# EasyEDA Pro project PCB.epro, board PCB1_1
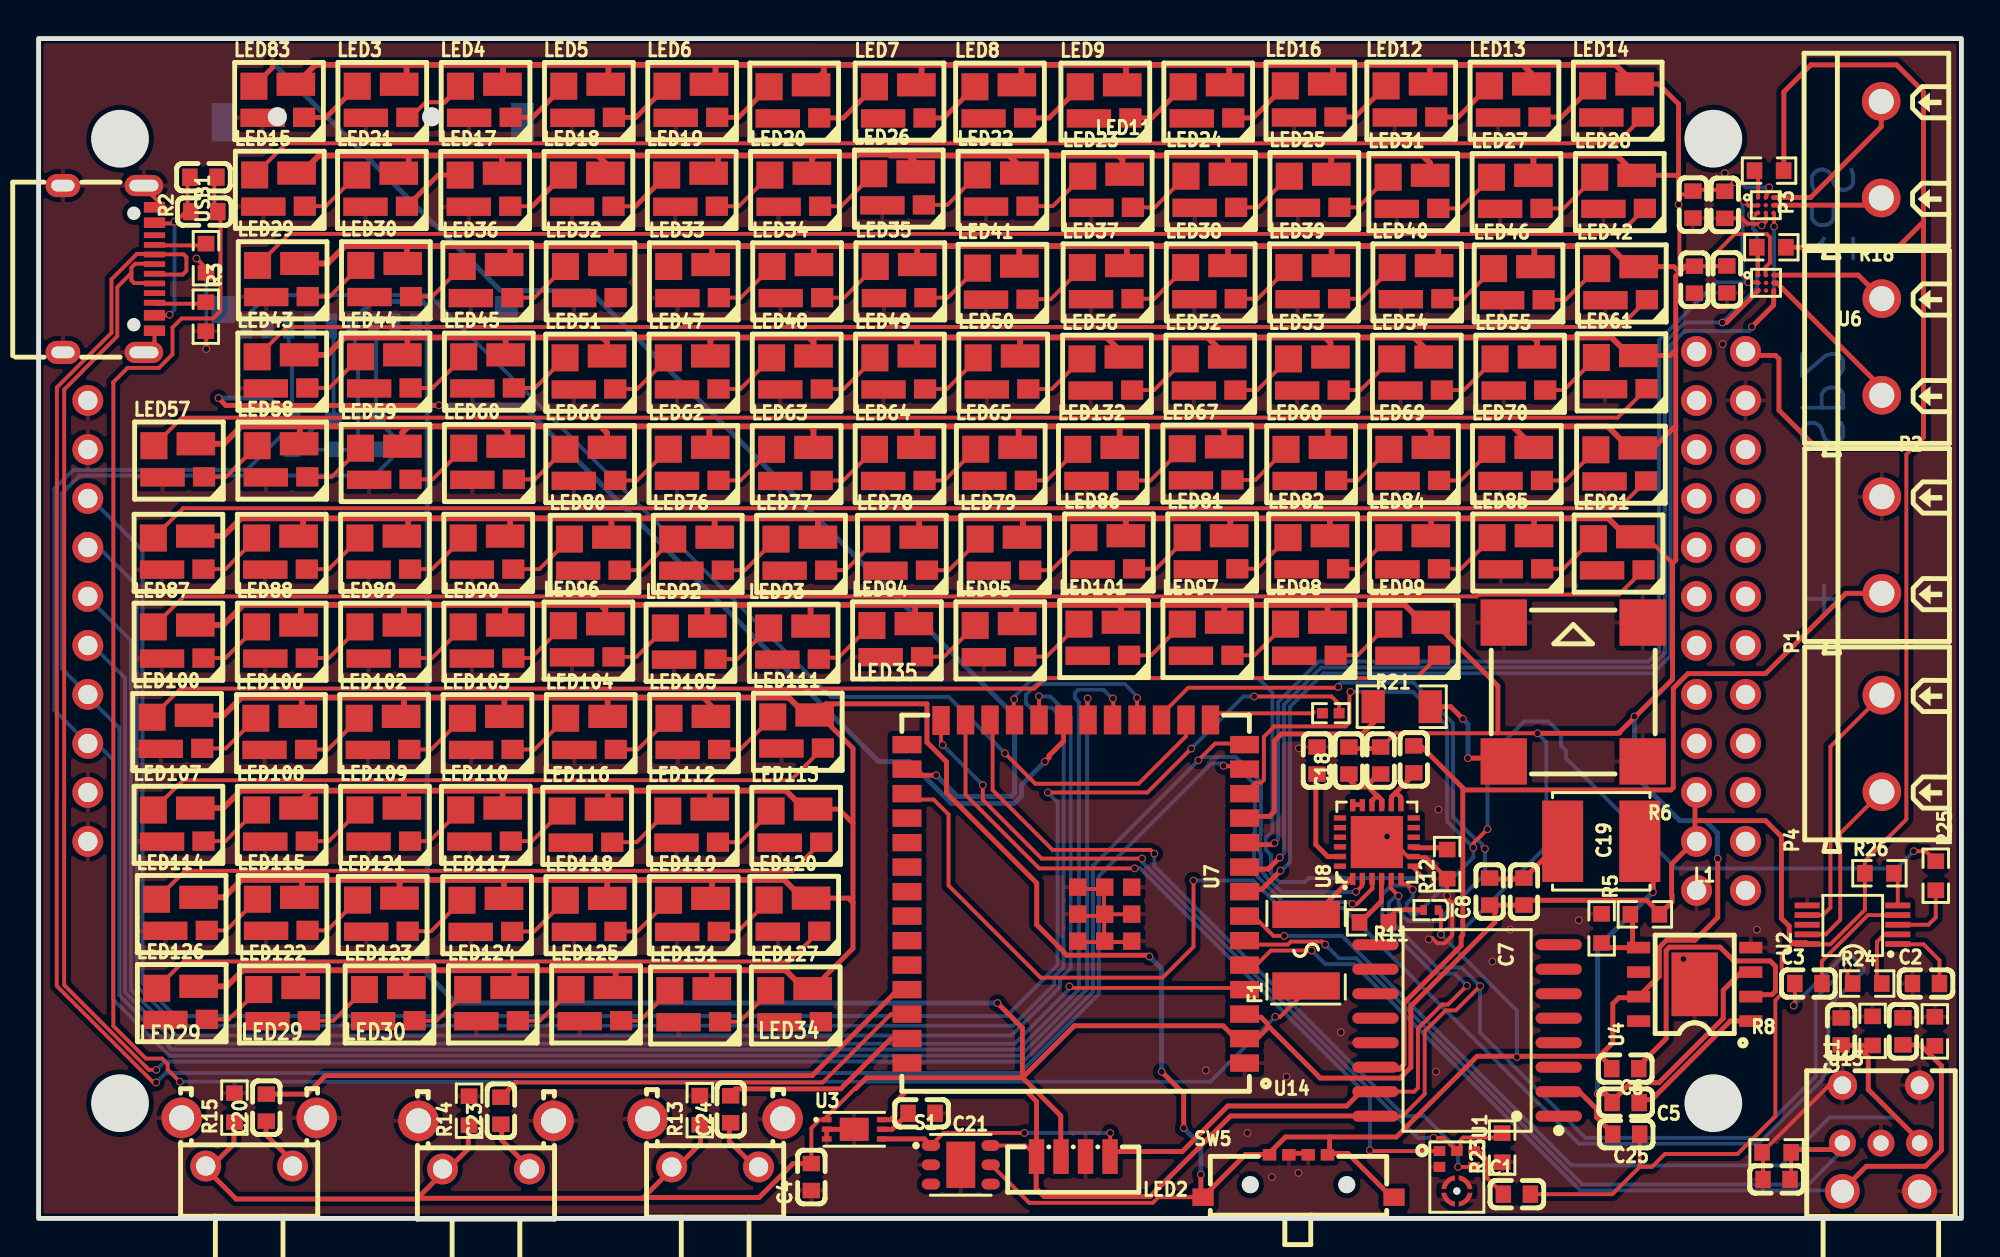
[diagram p0: board, top side]
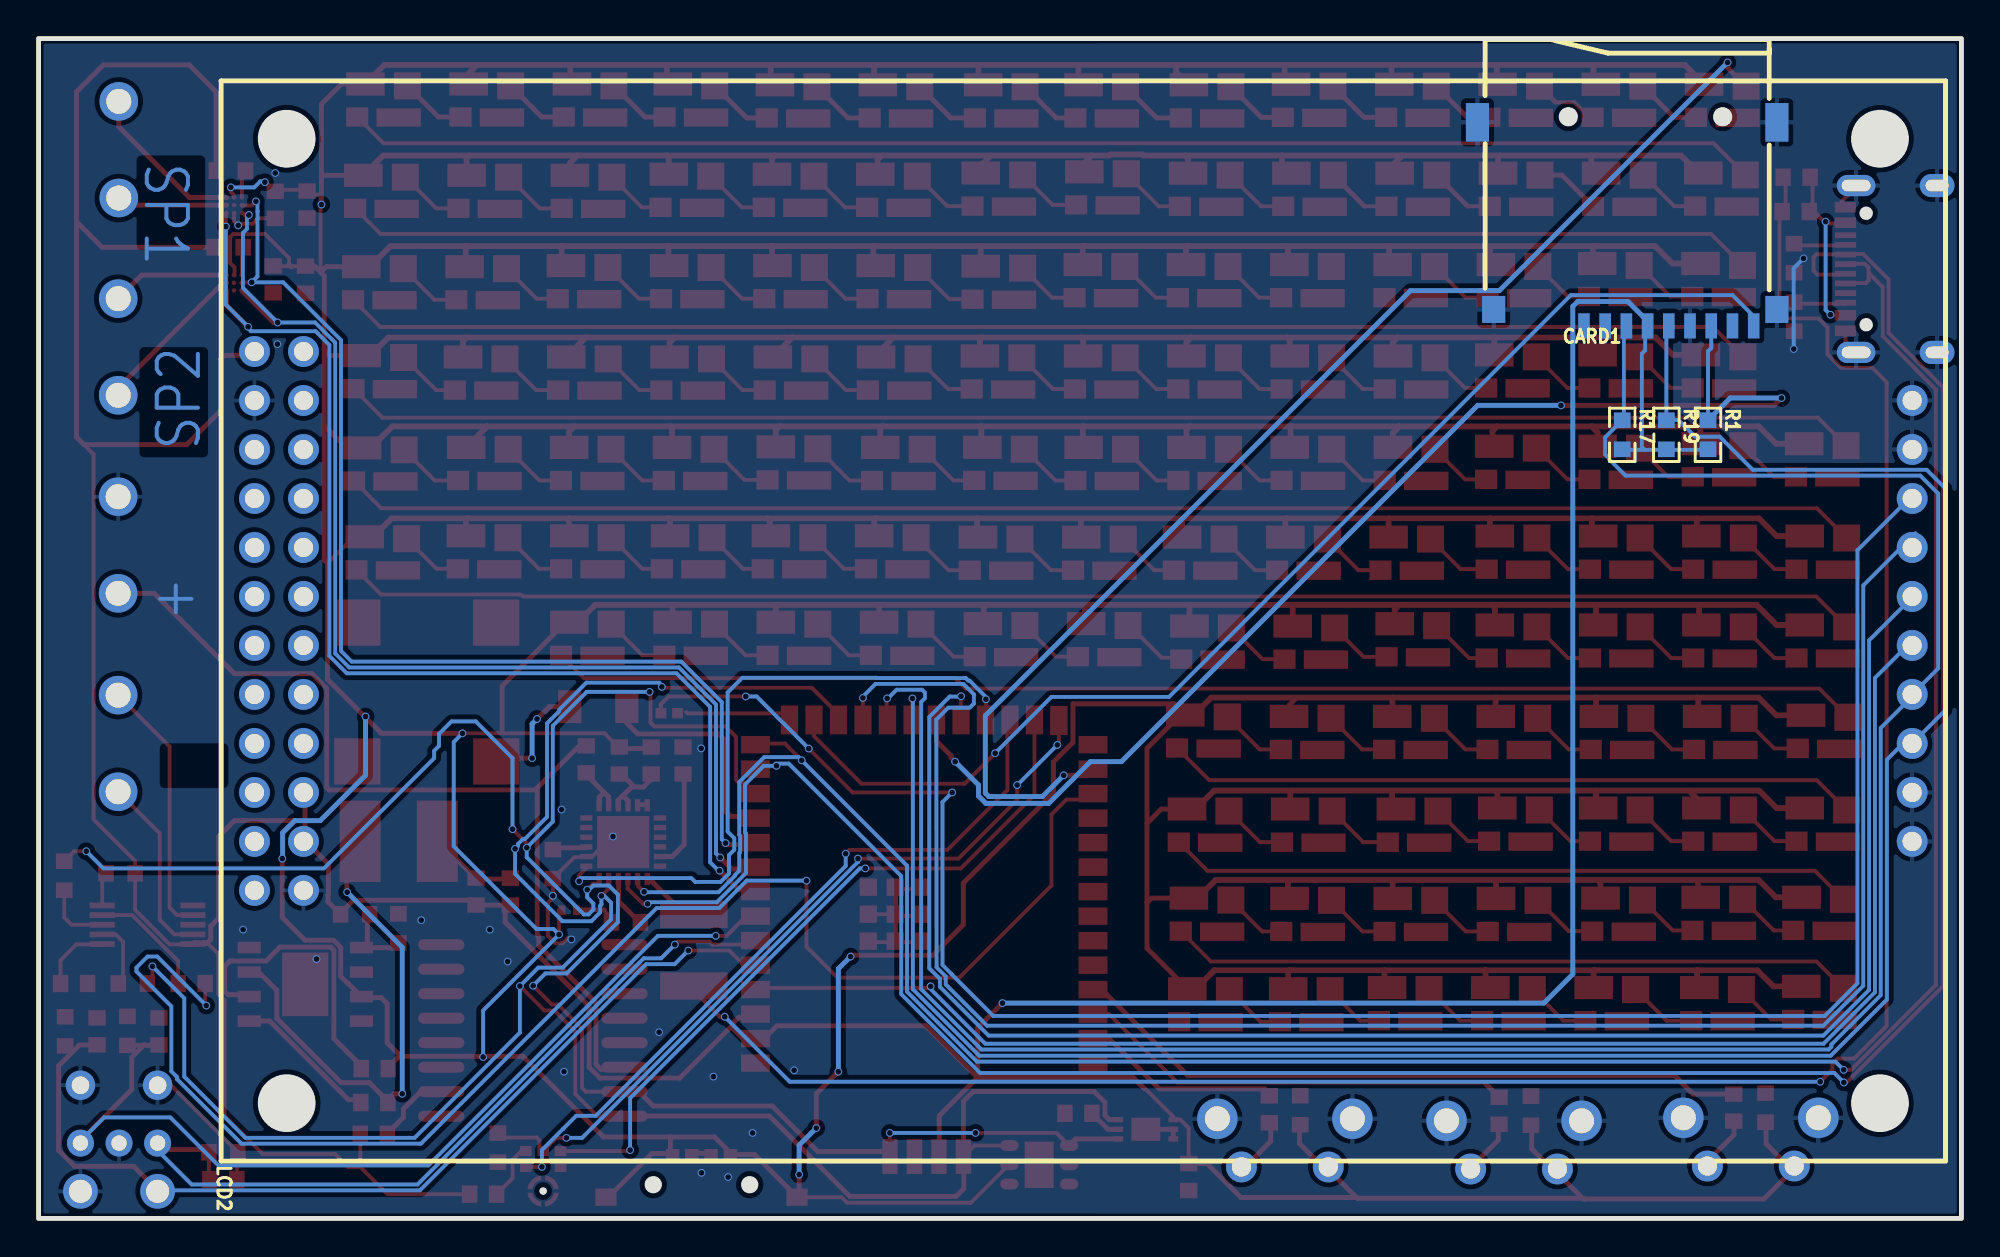
[diagram p1: board, bottom side, seen from below]

Outline 99.69 x 61.17 mm; copper layers: Top Layer, Bottom Layer. Coordinates in mm from the lower left corner of the outline.
Outline path: rectangle 0,61.17 99.69,0
Stack: Top Layer 0.035mm / Dielectric1 1.51mm FR4 er 4.5 / Bottom Layer 0.035mm

## Design rules (mm)
spacing copperThickness1oz (default): track to track 0.102, other pairs 0.152 to 0.3
spacing copperThickness2oz: track to track 0.203, other pairs 0.152 to 0.3
spacing Plane_innerPlane: track to track 0.102, other pairs 0.152 to 0.3
spacing Copper_copperRegion: track to track 0.102, other pairs 0.152 to 0.3
track width copperThickness1oz (default): min 0.1, default 0.254, max 2.54
track width copperThickness2oz: min 0.203, default 0.254, max 2.54
differential pair differentialPair (default): width min 0.127, default 0.254, max 2.54; gap min 0.152, default 0.152
pour e1061 uses Copper_copperRegion
pour e1062 uses Copper_copperRegion
pour e1063 uses Copper_copperRegion
pour e1210 uses Copper_copperRegion
pour e1280 uses Copper_copperRegion

## Placement (name value [footprint] x y rotation side)
BUZZER1  2.7kHz  [BUZ-SMD_4P-L8.5-W8.5-P8.50-BR]  79.56 27.29 0 top
C1  100nF  [C0603]  76.64 1.26 0 top
C2  1uF  [C0603]  97.85 12.18 0 top
C3  1uF  [C0603]  91.75 12.18 0 top
C4  100nF  [C0603]  40.06 2.15 90 top
C5  100nF  [C0603]  82.28 6.01 180 top
C6  10uF  [C0603]  82.26 7.77 180 top
C7  100nF  [C0603]  77 16.95 90 top
C8  22uF  [C0603]  75.23 16.95 90 top
C9  100nF  [C0603]  90.1 2.02 180 top
C10  100nF  [C0603]  93.45 9.69 270 top
C11  100nF  [C0603]  96.66 9.7 90 top
C12  1uF  [C0603]  87.52 48.68 90 top
C13  100nF  [C0603]  85.84 48.67 90 top
C14  100nF  [C0603]  66.28 23.74 90 top
C15  10uF  [C0603]  8.55 53.98 180 top
C16  100nF  [C0603]  8.59 52.2 180 top
C17  10uF  [C0603]  69.58 23.74 90 top
C18  100nF  [C0603]  67.93 23.74 90 top
C19  10uF  [C0603]  71.29 23.8 270 top
C20  100nF  [C0603]  11.81 5.74 90 top
C21  100nF  [C0603]  45.78 5.45 180 top
C23  100nF  [C0603]  23.97 5.58 90 top
C24  100nF  [C0603]  35.88 5.66 90 top
C25  100nF  [C0603]  82.31 4.37 180 top
C26  1uF  [C0603]  85.77 52.56 90 top
C27  100nF  [C0603]  87.42 52.55 90 top
CARD1  TF-01A  [TF-SMD_TF-01A]  17.33 51.55 0 bottom
F1  SMD1812P260TF/16  [F1812]  65.71 13.91 90 top
L1  4.7uH  [IND-SMD_L5.0-W5.0]  81.01 19.55 180 top
LCD2  HS32B01A  [LCD-TH_L89.4-W56.0_HS32B01A]  45.52 30.97 90 bottom
LED1  NCD0402R1  [LED-SMD_L1.0-W0.5_FC-F1005UGK]  72.18 15.98 180 top
LED2  VEML7700-TR  [LED-SMD_4P-L6.8-W2.4_VEML7700-TR]  53.64 3.21 180 top
LED3  SK6812MINI-B-012  [LED-SMD_4P-L3.5-W3.5-R-SK6812MINI]  17.82 57.93 0 top
LED4  SK6812MINI-B-012  [LED-SMD_4P-L3.5-W3.5-R-SK6812MINI]  23.17 57.93 0 top
LED5  SK6812MINI-B-012  [LED-SMD_4P-L3.5-W3.5-R-SK6812MINI]  28.53 57.93 0 top
LED6  SK6812MINI-B-012  [LED-SMD_4P-L3.5-W3.5-R-SK6812MINI]  33.88 57.93 0 top
LED7  SK6812MINI-B-012  [LED-SMD_4P-L3.5-W3.5-R-SK6812MINI]  44.63 57.9 0 top
LED8  SK6812MINI-B-012  [LED-SMD_4P-L3.5-W3.5-R-SK6812MINI]  49.84 57.9 0 top
LED9  SK6812MINI-B-012  [LED-SMD_4P-L3.5-W3.5-R-SK6812MINI]  55.3 57.9 0 top
LED10  SK6812MINI-B-012  [LED-SMD_4P-L3.5-W3.5-R-SK6812MINI]  60.64 57.9 0 top
LED11  SK6812MINI-B-012  [LED-SMD_4P-L3.5-W3.5-R-SK6812MINI]  39.17 57.9 0 top
LED12  SK6812MINI-B-012  [LED-SMD_4P-L3.5-W3.5-R-SK6812MINI]  71.16 57.95 0 top
LED13  SK6812MINI-B-012  [LED-SMD_4P-L3.5-W3.5-R-SK6812MINI]  76.51 57.95 0 top
LED14  SK6812MINI-B-012  [LED-SMD_4P-L3.5-W3.5-R-SK6812MINI]  81.87 57.95 0 top
LED15  SK6812MINI-B-012  [LED-SMD_4P-L3.5-W3.5-R-SK6812MINI]  12.5 53.33 0 top
LED16  SK6812MINI-B-012  [LED-SMD_4P-L3.5-W3.5-R-SK6812MINI]  65.93 57.95 0 top
LED17  SK6812MINI-B-012  [LED-SMD_4P-L3.5-W3.5-R-SK6812MINI]  23.15 53.32 0 top
LED18  SK6812MINI-B-012  [LED-SMD_4P-L3.5-W3.5-R-SK6812MINI]  28.51 53.32 0 top
LED19  SK6812MINI-B-012  [LED-SMD_4P-L3.5-W3.5-R-SK6812MINI]  33.86 53.32 0 top
LED20  SK6812MINI-B-012  [LED-SMD_4P-L3.5-W3.5-R-SK6812MINI]  39.21 53.32 0 top
LED21  SK6812MINI-B-012  [LED-SMD_4P-L3.5-W3.5-R-SK6812MINI]  17.8 53.32 0 top
LED22  SK6812MINI-B-012  [LED-SMD_4P-L3.5-W3.5-R-SK6812MINI]  49.97 53.33 0 top
LED23  SK6812MINI-B-012  [LED-SMD_4P-L3.5-W3.5-R-SK6812MINI]  55.43 53.26 0 top
LED24  SK6812MINI-B-012  [LED-SMD_4P-L3.5-W3.5-R-SK6812MINI]  60.78 53.26 0 top
LED25  SK6812MINI-B-012  [LED-SMD_4P-L3.5-W3.5-R-SK6812MINI]  66.14 53.26 0 top
LED26  SK6812MINI-B-012  [LED-SMD_4P-L3.5-W3.5-R-SK6812MINI]  44.6 53.39 0 top
LED27  SK6812MINI-B-012  [LED-SMD_4P-L3.5-W3.5-R-SK6812MINI]  76.62 53.21 0 top
LED28  SK6812MINI-B-012  [LED-SMD_4P-L3.5-W3.5-R-SK6812MINI]  81.97 53.21 0 top
LED29  SK6812MINI-B-012  [LED-SMD_4P-L3.5-W3.5-R-SK6812MINI]  12.65 48.64 0 top
LED30  SK6812MINI-B-012  [LED-SMD_4P-L3.5-W3.5-R-SK6812MINI]  18.01 48.64 0 top
LED31  SK6812MINI-B-012  [LED-SMD_4P-L3.5-W3.5-R-SK6812MINI]  71.27 53.21 0 top
LED32  SK6812MINI-B-012  [LED-SMD_4P-L3.5-W3.5-R-SK6812MINI]  28.61 48.58 0 top
LED33  SK6812MINI-B-012  [LED-SMD_4P-L3.5-W3.5-R-SK6812MINI]  33.97 48.58 0 top
LED34  SK6812MINI-B-012  [LED-SMD_4P-L3.5-W3.5-R-SK6812MINI]  39.32 48.58 0 top
LED35  SK6812MINI-B-012  [LED-SMD_4P-L3.5-W3.5-R-SK6812MINI]  44.68 48.58 0 top
LED36  SK6812MINI-B-012  [LED-SMD_4P-L3.5-W3.5-R-SK6812MINI]  23.26 48.58 0 top
LED37  SK6812MINI-B-012  [LED-SMD_4P-L3.5-W3.5-R-SK6812MINI]  55.41 48.53 0 top
LED38  SK6812MINI-B-012  [LED-SMD_4P-L3.5-W3.5-R-SK6812MINI]  60.77 48.53 0 top
LED39  SK6812MINI-B-012  [LED-SMD_4P-L3.5-W3.5-R-SK6812MINI]  66.12 48.53 0 top
LED40  SK6812MINI-B-012  [LED-SMD_4P-L3.5-W3.5-R-SK6812MINI]  71.47 48.53 0 top
LED41  SK6812MINI-B-012  [LED-SMD_4P-L3.5-W3.5-R-SK6812MINI]  49.97 48.5 0 top
LED42  SK6812MINI-B-012  [LED-SMD_4P-L3.5-W3.5-R-SK6812MINI]  82.08 48.47 0 top
LED43  SK6812MINI-B-012  [LED-SMD_4P-L3.5-W3.5-R-SK6812MINI]  12.63 43.9 0 top
LED44  SK6812MINI-B-012  [LED-SMD_4P-L3.5-W3.5-R-SK6812MINI]  17.99 43.9 0 top
LED45  SK6812MINI-B-012  [LED-SMD_4P-L3.5-W3.5-R-SK6812MINI]  23.34 43.9 0 top
LED46  SK6812MINI-B-012  [LED-SMD_4P-L3.5-W3.5-R-SK6812MINI]  76.73 48.47 0 top
LED47  SK6812MINI-B-012  [LED-SMD_4P-L3.5-W3.5-R-SK6812MINI]  33.95 43.85 0 top
LED48  SK6812MINI-B-012  [LED-SMD_4P-L3.5-W3.5-R-SK6812MINI]  39.3 43.85 0 top
LED49  SK6812MINI-B-012  [LED-SMD_4P-L3.5-W3.5-R-SK6812MINI]  44.66 43.85 0 top
LED50  SK6812MINI-B-012  [LED-SMD_4P-L3.5-W3.5-R-SK6812MINI]  50.01 43.85 0 top
LED51  SK6812MINI-B-012  [LED-SMD_4P-L3.5-W3.5-R-SK6812MINI]  28.59 43.85 0 top
LED52  SK6812MINI-B-012  [LED-SMD_4P-L3.5-W3.5-R-SK6812MINI]  60.75 43.79 0 top
LED53  SK6812MINI-B-012  [LED-SMD_4P-L3.5-W3.5-R-SK6812MINI]  66.1 43.79 0 top
LED54  SK6812MINI-B-012  [LED-SMD_4P-L3.5-W3.5-R-SK6812MINI]  71.45 43.79 0 top
LED55  SK6812MINI-B-012  [LED-SMD_4P-L3.5-W3.5-R-SK6812MINI]  76.81 43.79 0 top
LED56  SK6812MINI-B-012  [LED-SMD_4P-L3.5-W3.5-R-SK6812MINI]  55.39 43.79 0 top
LED57  SK6812MINI-B-012  [LED-SMD_4P-L3.5-W3.5-R-SK6812MINI]  7.28 39.29 0 top
LED58  SK6812MINI-B-012  [LED-SMD_4P-L3.5-W3.5-R-SK6812MINI]  12.63 39.29 0 top
LED59  SK6812MINI-B-012  [LED-SMD_4P-L3.5-W3.5-R-SK6812MINI]  17.99 39.16 0 top
LED60  SK6812MINI-B-012  [LED-SMD_4P-L3.5-W3.5-R-SK6812MINI]  23.34 39.16 0 top
LED61  SK6812MINI-B-012  [LED-SMD_4P-L3.5-W3.5-R-SK6812MINI]  82.06 43.86 0 top
LED62  SK6812MINI-B-012  [LED-SMD_4P-L3.5-W3.5-R-SK6812MINI]  33.95 39.11 0 top
LED63  SK6812MINI-B-012  [LED-SMD_4P-L3.5-W3.5-R-SK6812MINI]  39.3 39.1 0 top
LED64  SK6812MINI-B-012  [LED-SMD_4P-L3.5-W3.5-R-SK6812MINI]  44.63 39.1 0 top
LED65  SK6812MINI-B-012  [LED-SMD_4P-L3.5-W3.5-R-SK6812MINI]  49.88 39.11 0 top
LED66  SK6812MINI-B-012  [LED-SMD_4P-L3.5-W3.5-R-SK6812MINI]  28.59 39.11 0 top
LED67  SK6812MINI-B-012  [LED-SMD_4P-L3.5-W3.5-R-SK6812MINI]  60.59 39.13 0 top
LED68  SK6812MINI-B-012  [LED-SMD_4P-L3.5-W3.5-R-SK6812MINI]  65.97 39.1 0 top
LED69  SK6812MINI-B-012  [LED-SMD_4P-L3.5-W3.5-R-SK6812MINI]  71.3 39.1 0 top
LED70  SK6812MINI-B-012  [LED-SMD_4P-L3.5-W3.5-R-SK6812MINI]  76.64 39.1 0 top
LED71  SK6812MINI-B-012  [LED-SMD_4P-L3.5-W3.5-R-SK6812MINI]  7.25 34.51 0 top
LED72  SK6812MINI-B-012  [LED-SMD_4P-L3.5-W3.5-R-SK6812MINI]  12.6 34.51 0 top
LED73  SK6812MINI-B-012  [LED-SMD_4P-L3.5-W3.5-R-SK6812MINI]  17.96 34.51 0 top
LED74  SK6812MINI-B-012  [LED-SMD_4P-L3.5-W3.5-R-SK6812MINI]  23.31 34.51 0 top
LED75  SK6812MINI-B-012  [LED-SMD_4P-L3.5-W3.5-R-SK6812MINI]  82.03 39.08 0 top
LED76  SK6812MINI-B-012  [LED-SMD_4P-L3.5-W3.5-R-SK6812MINI]  34.17 34.45 0 top
LED77  SK6812MINI-B-012  [LED-SMD_4P-L3.5-W3.5-R-SK6812MINI]  39.53 34.45 0 top
LED78  SK6812MINI-B-012  [LED-SMD_4P-L3.5-W3.5-R-SK6812MINI]  44.76 34.45 0 top
LED79  SK6812MINI-B-012  [LED-SMD_4P-L3.5-W3.5-R-SK6812MINI]  50.11 34.45 0 top
LED80  SK6812MINI-B-012  [LED-SMD_4P-L3.5-W3.5-R-SK6812MINI]  28.82 34.45 0 top
LED81  SK6812MINI-B-012  [LED-SMD_4P-L3.5-W3.5-R-SK6812MINI]  60.84 34.52 0 top
LED82  SK6812MINI-B-012  [LED-SMD_4P-L3.5-W3.5-R-SK6812MINI]  66.07 34.52 0 top
LED83  SK6812MINI-B-012  [LED-SMD_4P-L3.5-W3.5-R-SK6812MINI]  12.47 57.93 0 top
LED84  SK6812MINI-B-012  [LED-SMD_4P-L3.5-W3.5-R-SK6812MINI]  71.3 34.52 0 top
LED85  SK6812MINI-B-012  [LED-SMD_4P-L3.5-W3.5-R-SK6812MINI]  76.65 34.52 0 top
LED86  SK6812MINI-B-012  [LED-SMD_4P-L3.5-W3.5-R-SK6812MINI]  55.49 34.52 0 top
LED87  SK6812MINI-B-012  [LED-SMD_4P-L3.5-W3.5-R-SK6812MINI]  7.25 29.9 0 top
LED88  SK6812MINI-B-012  [LED-SMD_4P-L3.5-W3.5-R-SK6812MINI]  12.6 29.9 0 top
LED89  SK6812MINI-B-012  [LED-SMD_4P-L3.5-W3.5-R-SK6812MINI]  17.96 29.9 0 top
LED90  SK6812MINI-B-012  [LED-SMD_4P-L3.5-W3.5-R-SK6812MINI]  23.31 29.9 0 top
LED91  SK6812MINI-B-012  [LED-SMD_4P-L3.5-W3.5-R-SK6812MINI]  81.91 34.47 0 top
LED92  SK6812MINI-B-012  [LED-SMD_4P-L3.5-W3.5-R-SK6812MINI]  33.79 29.84 0 top
LED93  SK6812MINI-B-012  [LED-SMD_4P-L3.5-W3.5-R-SK6812MINI]  39.15 29.84 0 top
LED94  SK6812MINI-B-012  [LED-SMD_4P-L3.5-W3.5-R-SK6812MINI]  44.5 29.97 0 top
LED95  SK6812MINI-B-012  [LED-SMD_4P-L3.5-W3.5-R-SK6812MINI]  49.86 29.97 0 top
LED96  SK6812MINI-B-012  [LED-SMD_4P-L3.5-W3.5-R-SK6812MINI]  28.5 29.96 0 top
LED97  SK6812MINI-B-012  [LED-SMD_4P-L3.5-W3.5-R-SK6812MINI]  60.59 30.04 0 top
LED98  SK6812MINI-B-012  [LED-SMD_4P-L3.5-W3.5-R-SK6812MINI]  65.94 30.04 0 top
LED99  SK6812MINI-B-012  [LED-SMD_4P-L3.5-W3.5-R-SK6812MINI]  71.3 30.04 0 top
LED100  SK6812MINI-B-012  [LED-SMD_4P-L3.5-W3.5-R-SK6812MINI]  7.18 25.21 0 top
LED101  SK6812MINI-B-012  [LED-SMD_4P-L3.5-W3.5-R-SK6812MINI]  55.24 30.04 0 top
LED102  SK6812MINI-B-012  [LED-SMD_4P-L3.5-W3.5-R-SK6812MINI]  17.92 25.16 0 top
LED103  SK6812MINI-B-012  [LED-SMD_4P-L3.5-W3.5-R-SK6812MINI]  23.27 25.16 0 top
LED104  SK6812MINI-B-012  [LED-SMD_4P-L3.5-W3.5-R-SK6812MINI]  28.63 25.16 0 top
LED105  SK6812MINI-B-012  [LED-SMD_4P-L3.5-W3.5-R-SK6812MINI]  33.98 25.16 0 top
LED106  SK6812MINI-B-012  [LED-SMD_4P-L3.5-W3.5-R-SK6812MINI]  12.56 25.16 0 top
LED107  SK6812MINI-B-012  [LED-SMD_4P-L3.5-W3.5-R-SK6812MINI]  7.25 20.41 0 top
LED108  SK6812MINI-B-012  [LED-SMD_4P-L3.5-W3.5-R-SK6812MINI]  12.6 20.41 0 top
LED109  SK6812MINI-B-012  [LED-SMD_4P-L3.5-W3.5-R-SK6812MINI]  17.96 20.41 0 top
LED110  SK6812MINI-B-012  [LED-SMD_4P-L3.5-W3.5-R-SK6812MINI]  23.19 20.41 0 top
LED111  SK6812MINI-B-012  [LED-SMD_4P-L3.5-W3.5-R-SK6812MINI]  39.36 25.23 0 top
LED112  SK6812MINI-B-012  [LED-SMD_4P-L3.5-W3.5-R-SK6812MINI]  33.92 20.35 0 top
LED113  SK6812MINI-B-012  [LED-SMD_4P-L3.5-W3.5-R-SK6812MINI]  39.27 20.35 0 top
LED114  SK6812MINI-B-012  [LED-SMD_4P-L3.5-W3.5-R-SK6812MINI]  7.42 15.78 0 top
LED115  SK6812MINI-B-012  [LED-SMD_4P-L3.5-W3.5-R-SK6812MINI]  12.64 15.78 0 top
LED116  SK6812MINI-B-012  [LED-SMD_4P-L3.5-W3.5-R-SK6812MINI]  28.44 20.35 0 top
LED117  SK6812MINI-B-012  [LED-SMD_4P-L3.5-W3.5-R-SK6812MINI]  23.25 15.72 0 top
LED118  SK6812MINI-B-012  [LED-SMD_4P-L3.5-W3.5-R-SK6812MINI]  28.61 15.72 0 top
LED119  SK6812MINI-B-012  [LED-SMD_4P-L3.5-W3.5-R-SK6812MINI]  33.96 15.72 0 top
LED120  SK6812MINI-B-012  [LED-SMD_4P-L3.5-W3.5-R-SK6812MINI]  39.17 15.73 0 top
LED121  SK6812MINI-B-012  [LED-SMD_4P-L3.5-W3.5-R-SK6812MINI]  17.84 15.73 0 top
LED122  SK6812MINI-B-012  [LED-SMD_4P-L3.5-W3.5-R-SK6812MINI]  12.71 11.1 0 top
LED123  SK6812MINI-B-012  [LED-SMD_4P-L3.5-W3.5-R-SK6812MINI]  18.19 11.1 0 top
LED124  SK6812MINI-B-012  [LED-SMD_4P-L3.5-W3.5-R-SK6812MINI]  23.55 11.1 0 top
LED125  SK6812MINI-B-012  [LED-SMD_4P-L3.5-W3.5-R-SK6812MINI]  28.9 11.1 0 top
LED126  SK6812MINI-B-012  [LED-SMD_4P-L3.5-W3.5-R-SK6812MINI]  7.42 11.16 0 top
LED127  SK6812MINI-B-012  [LED-SMD_4P-L3.5-W3.5-R-SK6812MINI]  39.25 11.04 0 top
LED131  SK6812MINI-B-012  [LED-SMD_4P-L3.5-W3.5-R-SK6812MINI]  34.03 11.04 0 top
LED132  SK6812MINI-B-012  [LED-SMD_4P-L3.5-W3.5-R-SK6812MINI]  55.18 39.1 0 top
P1  WJ301V-5.0-02P-12-00A  [CONN-TH_2P-P5.00_WJ301V-5.00-2P]  95.56 34.91 90 top
P2  WJ301V-5.0-02P-12-00A  [CONN-TH_2P-P5.00_WJ301V-5.00-2P]  95.56 45.18 90 top
P3  WJ301V-5.0-02P-12-00A  [CONN-TH_2P-P5.00_WJ301V-5.00-2P]  95.53 55.41 90 top
P4  WJ301V-5.0-02P-12-00A  [CONN-TH_2P-P5.00_WJ301V-5.00-2P]  95.56 24.62 90 top
R1  10kΩ  [R0603]  13.14 40.63 270 bottom
R2  5.1kΩ  [R0603]  8.68 49.78 270 top
R3  5.1kΩ  [R0603]  8.67 46.75 270 top
R5  200kΩ  [R0603]  81.03 15.04 270 top
R6  100kΩ  [R0603]  83.27 15.76 0 top
R8  10kΩ  [R0603]  90.1 3.43 0 top
R9  10kΩ  [R0603]  95.08 9.72 90 top
R10  10kΩ  [R0603]  98.31 9.7 270 top
R11  1kΩ  [R0603]  69.24 15.35 180 top
R12  180  [R0603]  73.02 18.37 90 top
R13  10kΩ  [R0603]  34.28 5.61 90 top
R14  10kΩ  [R0603]  22.32 5.58 90 top
R15  10kΩ  [R0603]  10.16 5.74 90 top
R17  10kΩ  [R0603]  17.58 40.63 270 bottom
R18  10kΩ  [R0603]  89.83 50.35 180 top
R19  10kΩ  [R0603]  15.3 40.63 270 bottom
R20  10kΩ  [R0603]  89.71 54.32 180 top
R21  100Ω  [R1206]  70.67 26.53 0 top
R22  33Ω  [R0402]  66.99 26.19 0 top
R23  100kΩ  [R0603]  75.88 3.67 90 top
R24  2.2kΩ  [R0603]  94.8 12.18 0 top
R25  2.2kΩ  [R0603]  98.35 17.77 270 top
R26  10kΩ  [R0603]  95.43 17.89 0 top
S1  HDC1080DMBR  [SENSOR-SMD_HDC1080DMBR]  47.81 2.78 0 top
SW2  1-1825027-4  [SW-TH_1-1825027-4]  10.92 3.97 180 top
SW3  1-1825027-4  [SW-TH_1-1825027-4]  23.19 3.81 180 top
SW4  1-1825027-4  [SW-TH_1-1825027-4]  35.07 3.92 180 top
SW5  SSAG230400  [SW-SMD_SSAG230400]  65.32 2.2 0 top
U1  ICS-43434  [MIC-SMD_6P-L3.5-W2.7-P0.90-BL]  73.53 2.21 270 top
U2  DRV2605LDGSR  [VSSOP-10_L3.0-W3.0-P0.50-LS4.9-BL]  94.04 15.23 90 top
U3  BH1750FVI-TR  [WSOF-6_L2.6-W1.6-P0.50-TL-EP]  42.28 4.62 0 top
U4  MSMP2307DN-LF-Z  [ESOP-8_L4.9-W3.9-P1.27-LS6.0-BL-EP]  85.86 12.14 90 top
U6  MAX98357AEWL+T  [WLP-9_L1.4-W1.3-P0.40-R3-C3-BR]  89.56 48.51 180 top
U7  DS3231SN#T&R  [SOIC-16_L10.3-W7.5-P1.27-LS10.3-BL]  74.06 9.75 90 top
U8  BQ25895RTWR  [QFN-24_L4.0-W4.0-P0.50-TL-EP2.7]  69.38 19.51 90 top
U12  MAX98357AEWL+T  [WLP-9_L1.4-W1.3-P0.40-R3-C3-BR]  89.54 52.53 180 top
U13  ED0890DM-FE13.8S5.8-C10-2030  [SW-TH_CTR_ED0890DM-FE13.8S5.8-C10-2030]  95.51 4.15 0 top
U14  2.4GHz  [WIRELM-SMD_ESP32-S3-WROOM-1U]  53.77 16.95 180 top
USB1  TYPE-C 16PIN 2MD(073)  [USB-C-SMD_TYPE-C-16PIN-2MD-073]  3.63 49.22 270 top

## Footprints (pads in the part's own frame, mm; a bottom-side part is the same pattern mirrored in y, then rotated)
BUZ-SMD_4P-L8.5-W8.5-P8.50-BR
  rect 2.4x2.4 smd: 1(-3.6,-3.6) 2(3.6,-3.6) 3(3.599,3.599) 4(-3.6,3.6)
C0603
  rect 0.8x0.9 smd: 1(-0.7,0) 2(0.7,0)
CONN-TH_2P-P5.00_WJ301V-5.00-2P
  round 2 hole 1.3: 1(-2.505,0) 2(2.505,0)
ESOP-8_L4.9-W3.9-P1.27-LS6.0-BL-EP
  rect 0.6x1.2 smd: 1(-1.905,-2.909) 2(-0.635,-2.909) 3(0.635,-2.909) 4(1.905,-2.909) 5(1.905,2.909) 6(0.635,2.909) 7(-0.635,2.909) 8(-1.905,2.909)
  rect 3.3x2.4 smd: 9(0,0)
F1812
  rect 1.407x3.499 smd: 1(-1.853,0) 2(1.853,0)
IND-SMD_L5.0-W5.0
  rect 2.124x4.22 smd: 1(2,0) 2(-2,0)
LCD-TH_L89.4-W56.0_HS32B01A
  round 1.6 hole 1: 1(-13.97,40.43) 2(-13.97,42.97) 3(-11.43,40.43) 4(-11.43,42.97) 5(-8.89,40.43) 6(-8.89,42.97) 7(-6.35,40.43) 8(-6.35,42.97) 9(-3.81,40.43) 10(-3.81,42.97) 11(-1.27,40.43) 12(-1.27,42.97) 13(1.27,40.43) 14(1.27,42.97) 15(3.81,40.43) 16(3.81,42.97) 17(6.35,40.43) 18(6.35,42.97) 19(8.89,40.43) 20(8.89,42.97) 21(11.43,40.43) 22(11.43,42.97) 23(13.97,40.43) 24(13.97,42.97) 25(-11.43,-42.97) 26(-8.89,-42.97) 27(-6.35,-42.97) 28(-3.81,-42.97) 29(-1.27,-42.97) 30(1.27,-42.97) 31(3.81,-42.97) 32(6.35,-42.97) 33(8.89,-42.97) 34(11.43,-42.97)
LED-SMD_4P-L3.5-W3.5-R-SK6812MINI
  rect 1.15x1 smd: 1(1.3,-0.845)
  rect 2x1.2 smd: 2(0.875,0.87)
  rect 1.4x1.4 smd: 3(-1.3,0.77)
  rect 2.3x0.95 smd: 4(-0.85,-0.87)
LED-SMD_4P-L6.8-W2.4_VEML7700-TR
  rect 0.8x1.8 smd: 1(1.905,0) 2(0.635,0) 3(-0.635,0) 4(-1.905,0)
LED-SMD_L1.0-W0.5_FC-F1005UGK
  rect 0.35x0.5 smd: 1(-0.375,0) 2(0.375,0)
MIC-SMD_6P-L3.5-W2.7-P0.90-BL
  rect 0.52x0.6 smd: 1(-1.286,-0.9) 2(-0.465,-0.9) 4(-0.465,0.9) 5(-1.286,0.9) 6(-1.286,0)
  custom 0.709x0.71 smd: 3(0.276,-0.452) 3(0.329,0.505) 3(1.234,-0.505) 3(1.286,0.452)
QFN-24_L4.0-W4.0-P0.50-TL-EP2.7
  rect 0.633x0.28 smd: 1(-1.911,1.25) 2(-1.911,0.75) 3(-1.911,0.25) 4(-1.911,-0.25) 5(-1.911,-0.75) 6(-1.911,-1.25) 13(1.911,-1.25) 14(1.911,-0.75) 15(1.911,-0.25) 16(1.911,0.25) 17(1.911,0.75) 18(1.911,1.25)
  rect 0.28x0.633 smd: 7(-1.25,-1.911) 8(-0.75,-1.911) 9(-0.25,-1.911) 10(0.25,-1.911) 11(0.75,-1.911) 12(1.25,-1.911) 19(1.25,1.911) 20(0.75,1.911) 21(0.25,1.911) 22(-0.25,1.911) 23(-0.75,1.911) 24(-1.25,1.911)
  rect 2.7x2.7 smd: 25(0,0)
R0402
  rect 0.566x0.54 smd: 1(-0.433,0) 2(0.433,0)
R0603
  rect 0.806x0.864 smd: 1(-0.753,0) 2(0.753,0)
R1206
  rect 1.208x1.701 smd: 1(-1.479,0) 2(1.479,0)
SENSOR-SMD_HDC1080DMBR
  oval 0.95x0.56 smd: 1(-1.548,1) 2(-1.548,0) 3(-1.548,-1) 4(1.548,-1) 5(1.548,0) 6(1.548,1)
  rect 1.5x2.4 smd: 7(0,0)
SOIC-16_L10.3-W7.5-P1.27-LS10.3-BL
  oval 0.574x2.401 smd: 1(-4.445,-4.75) 2(-3.175,-4.75) 3(-1.905,-4.75) 4(-0.635,-4.75) 5(0.635,-4.75) 6(1.905,-4.75) 7(3.175,-4.75) 8(4.445,-4.75) 9(4.445,4.75) 10(3.175,4.75) 11(1.905,4.75) 12(0.635,4.75) 13(-0.635,4.75) 14(-1.905,4.75) 15(-3.175,4.75) 16(-4.445,4.75)
SW-SMD_SSAG230400
  rect 1.1x0.9 smd: 0(-4.95,-1.1) 0(4.95,-1.1)
  rect 0.7x0.6 smd: 1(-1.5,1.1) 2(-0.5,1.1) 3(0.5,1.1) 4(1.5,1.1)
SW-TH_1-1825027-4
  round 1.6 hole 1: 1(2.25,1.25) 2(-2.25,1.25)
  round 2.1 hole 1.3: 3(3.5,-1.25) 4(-3.5,-1.25)
SW-TH_CTR_ED0890DM-FE13.8S5.8-C10-2030
  round 1.8 hole 1.2: 1(2,-2.75) 2(-2,-2.75)
  round 1.4 hole 0.8: A(2,-0.25) B(-2,-0.25) C(0,-0.25)
  round 1.524 hole 0.914: S1(-2,2.75) S2(2,2.75)
TF-SMD_TF-01A
  rect 0.6x1.3 smd: 1(2.24,5.276) 2(1.14,5.276) 3(0.04,5.276) 4(-1.06,5.276) 5(-2.16,5.276) 6(-3.26,5.276) 7(-4.36,5.276) 8(-5.46,5.276) 9(-6.56,5.276)
  rect 1.2x1.4 smd: 10(-7.76,4.426) 13(6.92,4.426)
  rect 1.2x2 smd: 11(-7.76,-5.276) 12(7.76,-5.276)
USB-C-SMD_TYPE-C-16PIN-2MD-073
  oval 1.1x2 hole 0.6x1.5: 13(-4.325,1.825) 14(4.325,1.825)
  oval 1.2x1.8 hole 0.6x1.2: 13(-4.325,-2.375) 14(4.325,-2.375)
  rect 0.55x1.1 smd: A1B12(-3.2,2.375) A4B9(-2.4,2.375) B1A12(3.2,2.375) B4A9(2.4,2.375)
  rect 0.3x1.1 smd: A5(-1.25,2.375) A6(-0.25,2.375) A7(0.25,2.375) A8(1.25,2.375) B5(1.75,2.375) B6(0.75,2.375) B7(-0.75,2.375) B8(-1.75,2.375)
VSSOP-10_L3.0-W3.0-P0.50-LS4.9-BL
  rect 0.3x1.3 smd: 1(-1,-2.35) 2(-0.5,-2.35) 3(0,-2.35) 4(0.5,-2.35) 5(1,-2.35) 6(1,2.35) 7(0.5,2.35) 8(0,2.35) 9(-0.5,2.35) 10(-1,2.35)
WIRELM-SMD_ESP32-S3-WROOM-1U
  rect 1.5x0.9 smd: 1(-8.75,8.895) 2(-8.75,7.625) 3(-8.75,6.355) 4(-8.75,5.085) 5(-8.75,3.815) 6(-8.75,2.545) 7(-8.75,1.275) 8(-8.75,0.005) 9(-8.75,-1.265) 10(-8.75,-2.535) 11(-8.75,-3.805) 12(-8.75,-5.075) 13(-8.75,-6.345) 14(-8.75,-7.615) 27(8.75,-7.615) 28(8.75,-6.345) 29(8.75,-5.075) 30(8.75,-3.805) 31(8.75,-2.535) 32(8.75,-1.265) 33(8.75,0.005) 34(8.75,1.275) 35(8.75,2.545) 36(8.75,3.815) 37(8.75,5.085) 38(8.75,6.355) 39(8.75,7.625) 40(8.75,8.895)
  rect 0.9x1.5 smd: 15(-6.985,-8.895) 16(-5.715,-8.895) 17(-4.445,-8.895) 18(-3.175,-8.895) 19(-1.905,-8.895) 20(-0.635,-8.895) 21(0.635,-8.895) 22(1.905,-8.895) 23(3.175,-8.895) 24(4.445,-8.895) 25(5.715,-8.895) 26(6.985,-8.865)
  rect 0.9x0.9 smd: 41(-2.9,2.575) 41(-2.9,1.175) 41(-2.9,-0.225) 41(-1.5,2.575) 41(-1.5,1.175) 41(-1.5,-0.225) 41(-0.1,2.575) 41(-0.1,1.175) 41(-0.1,-0.225)
WLP-9_L1.4-W1.3-P0.40-R3-C3-BR
  round 0.23 smd: A1(0.4,-0.4) A2(0,-0.4) A3(-0.4,-0.4) B1(0.4,0) B2(0,0) B3(-0.4,0) C1(0.4,0.4) C2(0,0.4) C3(-0.4,0.4)
WSOF-6_L2.6-W1.6-P0.50-TL-EP
  rect 0.505x0.28 smd: 1(-1.427,0.5) 2(-1.427,0) 3(-1.427,-0.5) 4(1.427,-0.5) 5(1.427,0) 6(1.427,0.5)
  rect 1.5x1.2 smd: 7(0,0)

## Nets
+3.3V: C1.2 C4.2 C7.1 C8.1 C25.1 CARD1.4 LCD2.3 LCD2.5 LCD2.24 LED2.2 R1.2 R6.2 R13.1 R14.1 R15.1 R17.2 R18.1 R19.2 R20.1 R26.1 SW2.1 SW3.1 SW4.1 U2.10 U3.1 U14.2 U14.3
+5V: C6.2 C12.2 C13.2 C17.2 C18.2 C26.2 C27.2 LED1.1 LED3.2 LED4.2 LED5.2 LED6.2 LED7.2 LED8.2 LED9.2 LED10.2 LED11.2 LED12.2 LED13.2 LED14.2 LED15.2 LED16.2 LED17.2 LED18.2 LED19.2 LED20.2 LED21.2 LED22.2 LED23.2 LED24.2 LED25.2 LED26.2 LED27.2 LED28.2 LED29.2 LED30.2 LED31.2 LED32.2 LED33.2 LED34.2 LED35.2 LED36.2 LED37.2 LED38.2 LED39.2 LED40.2 LED41.2 LED42.2 LED43.2 LED44.2 LED45.2 LED46.2 LED47.2 LED48.2 LED49.2 LED50.2 LED51.2 LED52.2 LED53.2 LED54.2 LED55.2 LED56.2 LED57.2 LED58.2 LED59.2 LED60.2 LED61.2 LED62.2 LED63.2 LED64.2 LED65.2 LED66.2 LED67.2 LED68.2 LED69.2 LED70.2 LED71.2 LED72.2 LED73.2 LED74.2 LED75.2 LED76.2 LED77.2 LED78.2 LED79.2 LED80.2 LED81.2 LED82.2 LED83.2 LED84.2 LED85.2 LED86.2 LED87.2 LED88.2 LED89.2 LED90.2 LED91.2 LED92.2 LED93.2 LED94.2 LED95.2 LED96.2 LED97.2 LED98.2 LED99.2 LED100.2 LED101.2 LED102.2 LED103.2 LED104.2 LED105.2 LED106.2 LED107.2 LED108.2 LED109.2 LED110.2 LED111.2 LED112.2 LED113.2 LED114.2 LED115.2 LED116.2 LED117.2 LED118.2 LED119.2 LED120.2 LED121.2 LED122.2 LED123.2 LED124.2 LED125.2 LED126.2 LED127.2 LED131.2 LED132.2 S1.5 SW5.0 SW5.1 SW5.4 U4.7 U6.A2 U12.A2
GND: BUZZER1.2 BUZZER1.3 BUZZER1.4 C2.1 C4.1 C9.2 C10.1 C11.2 C12.1 C13.1 C14.2 C21.1 C26.1 C27.1 CARD1.6 CARD1.10 CARD1.11 CARD1.12 CARD1.13 LCD2.1 LCD2.22 LCD2.25 LCD2.26 LCD2.33 LCD2.34 LED2.3 LED3.4 LED4.4 LED5.4 LED6.4 LED7.4 LED8.4 LED9.4 LED10.4 LED11.4 LED12.4 LED13.4 LED14.4 LED15.4 LED16.4 LED17.4 LED18.4 LED19.4 LED20.4 LED21.4 LED22.4 LED23.4 LED24.4 LED25.4 LED26.4 LED27.4 LED28.4 LED29.4 LED30.4 LED31.4 LED32.4 LED33.4 LED34.4 LED35.4 LED36.4 LED37.4 LED38.4 LED39.4 LED40.4 LED41.4 LED42.4 LED43.4 LED44.4 LED45.4 LED46.4 LED47.4 LED48.4 LED49.4 LED50.4 LED51.4 LED52.4 LED53.4 LED54.4 LED55.4 LED56.4 LED57.4 LED58.4 LED59.4 LED60.4 LED61.4 LED62.4 LED63.4 LED64.4 LED65.4 LED66.4 LED67.4 LED68.4 LED69.4 LED70.4 LED71.4 LED72.4 LED73.4 LED74.4 LED75.4 LED76.4 LED77.4 LED78.4 LED79.4 LED80.4 LED81.4 LED82.4 LED83.4 LED84.4 LED85.4 LED86.4 LED87.4 LED88.4 LED89.4 LED90.4 LED91.4 LED92.4 LED93.4 LED94.4 LED95.4 LED96.4 LED97.4 LED98.4 LED99.4 LED100.4 LED101.4 LED102.4 LED103.4 LED104.4 LED105.4 LED106.4 LED107.4 LED108.4 LED109.4 LED110.4 LED111.4 LED112.4 LED113.4 LED114.4 LED115.4 LED116.4 LED117.4 LED118.4 LED119.4 LED120.4 LED121.4 LED122.4 LED123.4 LED124.4 LED125.4 LED126.4 LED127.4 LED131.4 LED132.4 P1.2 R2.2 R3.2 R5.1 R8.1 R9.2 R10.1 R12.1 R13.2 R14.2 R15.2 R23.1 S1.2 S1.7 SW2.3 SW2.4 SW3.3 SW3.4 SW4.3 SW4.4 SW5.2 SW5.3 U1.2 U1.3 U2.6 U2.8 U3.2 U3.3 U3.7 U4.4 U4.9 U6.C2 U7.13 U8.8 U8.25 U12.C2 U13.1 U13.C U13.S1 U13.S2 U14.1 U14.40 U14.41 USB1.13 USB1.14 USB1.A1B12 USB1.B1A12
PGND: U8.17 U8.18
VBUS: C15.2 C16.2 USB1.A4B9 USB1.B4A9
+BAT: C19.1 P1.1 U7.14
A: C9.1 R8.2 U13.B U14.6
B: C10.2 R9.1 U13.A U14.7
BACK: C23.2 U14.38
BCLK: U6.C1 U12.C1 U14.9
BUZZER: R21.1 U14.11
CS: LCD2.31 U14.18
DIN: U6.B1 U12.B1 U14.10
EXTRA: C24.2 U14.39
HOME: C20.2 U14.37
IN_TRIG: C3.1 U14.29
INT: U8.7 U14.23
LED: R22.1 U14.15
LED_DATA: LED83.3 U14.28
LRCLK: U6.C3 U12.C3 U14.8
MIC_SCK: U1.4 U14.24
MIC_SD: R23.2 U1.6 U14.26
MIC_WS: U1.1 U14.25
MISO: CARD1.7 R1.1 U14.21
MOSI: CARD1.3 LCD2.28 R17.1 U14.19
OUT+: P4.2 U2.7
OUT-: P4.1 U2.9
OUTN: P2.1 U6.B3
OUTN_2: P3.1 U12.B3
OUTP: P2.2 U6.A3
OUTP_2: P3.2 U12.A3
RESET: LCD2.29 U14.4
RS: LCD2.30 U14.22
SCK: CARD1.5 LCD2.27 R19.1 U14.20
SCL: LED2.1 R24.1 S1.6 U3.6 U7.16 U8.5 U14.17
SD_CS: CARD1.9 U14.16
SDA: LED2.4 R25.1 S1.1 U3.4 U7.15 U8.6 U14.12
SW: C11.1 R10.2 U13.2 U14.5
USB_DN: U8.3 U14.13 USB1.A7 USB1.B7
USB_DP: U8.2 U14.14 USB1.A6 USB1.B6
$1N6578: R2.1 USB1.A5
$1N6634: R3.1 USB1.B5
$1N7983: R5.2 R6.1 U4.5
$1N8057: C5.2 L1.2 U4.3
$1N8372: C5.1 U4.1
$1N8401: C6.1 U4.2
$1N8430: C7.2 C8.2 L1.1
$1N18930: F1.2 U8.1
$1N18990: C14.1 U8.23
$1N19229: R11.2 U8.4
$1N19351: LED1.2 R11.1
$1N19411: R12.2 U8.9
$1N19477: C15.1 C16.1 F1.1
$1N19620: C17.1 C18.1 U8.15 U8.16
$1N20619: C25.2 U7.2
$1N20701: R18.2 U6.A1
$1N28718: R20.2 U12.A1
$1N28971: C20.1 SW2.2
$1N29356: C23.1 SW3.2
$1N29358: C24.1 SW4.2
$1N34221: C19.2 U8.13 U8.14
$1N34247: BUZZER1.1 R21.2
$1N38180: LCD2.32 R22.2
$1N46615: C1.1 U1.5
$1N46618: C2.2 U2.1
$1N46619: R25.2 U2.3
$1N46621: C3.2 U2.4
$1N46635: C21.2 U3.5
$1N46638: R26.2 U2.5
$1N46646: R24.2 U2.2
$2N178: LED3.3 LED83.1
$2N179: LED3.1 LED4.3
$2N180: LED4.1 LED5.3
$2N181: LED5.1 LED6.3
$2N182: LED7.3 LED11.1
$2N183: LED7.1 LED8.3
$2N184: LED9.1 LED10.3
$2N185: LED12.3 LED16.1
$2N186: LED12.1 LED13.3
$2N187: LED13.1 LED14.3
$2N188: LED8.1 LED9.3
$2N189: LED14.1 LED15.3
$2N190: LED17.3 LED21.1
$2N191: LED17.1 LED18.3
$2N192: LED18.1 LED19.3
$2N193: LED19.1 LED20.3
$2N194: LED22.3 LED26.1
$2N195: LED22.1 LED23.3
$2N196: LED23.1 LED24.3
$2N197: LED24.1 LED25.3
$2N198: LED27.3 LED31.1
$2N199: LED27.1 LED28.3
$2N200: LED28.1 LED29.3
$2N201: LED29.1 LED30.3
$2N202: LED32.3 LED36.1
$2N203: LED32.1 LED33.3
$2N204: LED33.1 LED34.3
$2N205: LED34.1 LED35.3
$2N206: LED37.3 LED41.1
$2N207: LED37.1 LED38.3
$2N208: LED38.1 LED39.3
$2N209: LED39.1 LED40.3
$2N210: LED42.3 LED46.1
$2N211: LED42.1 LED43.3
$2N212: LED43.1 LED44.3
$2N213: LED44.1 LED45.3
$2N214: LED47.3 LED51.1
$2N215: LED47.1 LED48.3
$2N216: LED48.1 LED49.3
$2N217: LED49.1 LED50.3
$2N218: LED52.3 LED56.1
$2N219: LED52.1 LED53.3
$2N220: LED53.1 LED54.3
$2N221: LED54.1 LED55.3
$2N222: LED57.3 LED61.1
$2N223: LED57.1 LED58.3
$2N224: LED58.1 LED59.3
$2N225: LED59.1 LED60.3
$2N226: LED62.3 LED66.1
$2N227: LED62.1 LED63.3
$2N228: LED63.1 LED64.3
$2N229: LED64.1 LED65.3
$2N231: LED6.1 LED11.3
$2N232: LED10.1 LED16.3
$2N233: LED15.1 LED21.3
$2N234: LED20.1 LED26.3
$2N235: LED25.1 LED31.3
$2N236: LED30.1 LED36.3
$2N237: LED40.1 LED46.3
$2N238: LED35.1 LED41.3
$2N239: LED45.1 LED51.3
$2N240: LED50.1 LED56.3
$2N241: LED55.1 LED61.3
$2N242: LED60.1 LED66.3
$2N250: LED125.1 LED131.3
$2N251: LED120.1 LED126.3
$2N252: LED115.1 LED121.3
$2N253: LED110.1 LED116.3
$2N254: LED100.1 LED106.3
$2N255: LED105.1 LED111.3
$2N256: LED95.1 LED101.3
$2N257: LED90.1 LED96.3
$2N258: LED85.1 LED91.3
$2N259: LED79.1 LED86.3
$2N260: LED74.1 LED80.3
$2N261: LED70.1 LED75.3
$2N266: LED127.3 LED131.1
$2N267: LED124.1 LED125.3
$2N268: LED123.1 LED124.3
$2N269: LED122.1 LED123.3
$2N270: LED122.3 LED126.1
$2N271: LED119.1 LED120.3
$2N272: LED118.1 LED119.3
$2N273: LED117.1 LED118.3
$2N274: LED117.3 LED121.1
$2N275: LED114.1 LED115.3
$2N276: LED113.1 LED114.3
$2N277: LED112.1 LED113.3
$2N278: LED112.3 LED116.1
$2N279: LED109.1 LED110.3
$2N280: LED108.1 LED109.3
$2N281: LED107.1 LED108.3
$2N282: LED107.3 LED111.1
$2N283: LED104.1 LED105.3
$2N284: LED103.1 LED104.3
$2N285: LED102.1 LED103.3
$2N286: LED102.3 LED106.1
$2N287: LED99.1 LED100.3
$2N288: LED98.1 LED99.3
$2N289: LED97.1 LED98.3
$2N290: LED97.3 LED101.1
$2N291: LED94.1 LED95.3
$2N292: LED93.1 LED94.3
$2N293: LED92.1 LED93.3
$2N294: LED92.3 LED96.1
$2N295: LED89.1 LED90.3
$2N296: LED88.1 LED89.3
$2N297: LED87.1 LED88.3
$2N298: LED87.3 LED91.1
$2N299: LED84.1 LED85.3
$2N300: LED82.1 LED84.3
$2N301: LED81.1 LED82.3
$2N302: LED81.3 LED86.1
$2N303: LED78.1 LED79.3
$2N304: LED72.1 LED73.3
$2N305: LED77.1 LED78.3
$2N306: LED76.1 LED77.3
$2N307: LED76.3 LED80.1
$2N308: LED73.1 LED74.3
$2N309: LED71.1 LED72.3
$2N310: LED71.3 LED75.1
$2N311: LED69.1 LED70.3
$2N312: LED68.1 LED69.3
$2N313: LED67.1 LED68.3
$2N314: LED67.3 LED132.1
$2N328: LED65.1 LED132.3

Pads without a net: CARD1 1 2 8; LCD2 2 4 6 7 8 9 10 11 12 13 14 15 16 17 18 19 20 21 23; LED127 1; S1 3 4; U4 6 8; U6 B2; U7 1 3 4 5 6 7 8 9 10 11 12; U8 10 11 12 19 20 21 22 24; U12 B2; U14 27 30 31 32 33 34 35 36; USB1 A8 B8

## Via types
v1: diameter 0.4, hole 0.3, Top Layer to Bottom Layer, 100 vias

## Routing (per net, layer and track width the routed paths; a pad name or vN(x,y) marks a point on that pad's centre or on a via; arc(x,y) is an arc through that point)
+3.3V: length 317
  Top Layer w0.2: 83.01,2.67 83.64,2.67 84.31,3.34 88.07,3.34 90.04,5.31 90.04,11.31 90.37,11.64 90.37,13.72 90.88,14.23 U2.10 ; 83.01,2.67 C25.1 ; 83.01,2.67 81.59,1.26 C1.2 ; C4.2 40.06,4.69 40.5,5.12 U3.1 40.86,5.27 42.31,6.73 42.36,6.73 ; 97.34,40.12 96.83,39.61 96.83,20.69 94.68,18.54 R26.1 94.68,16 92.89,14.21 91.7,14.21
  Top Layer w0.254: 32.84,2.41 34.32,3.88 34.32,4.89 ; 31.36,1.08 31.32,1.05 31.28,1.05 ; 31.36,1.08 37.35,1.08 39.11,2.85 C4.2 ; 31.36,1.08 31.28,1.05 ; 31.36,1.08 32.8,2.53 ; 21.27,2.6 22.28,3.61 22.28,4.87 ; 85.87,19.84 85.87,20.62 ; 85.87,20.62 89.53,20.62 90.35,19.8 90.35,15.56 90.76,15.16 90.76,14.46 90.92,14.3 91.62,14.3 U2.10 ; 85.87,20.62 85.87,22.35 85.7,22.53 ; 31.28,1.05 19.64,1.05 ; 51,7.3 42.93,7.3 42.36,6.73 ; 51,7.3 51.02,7.3 52.99,5.32 52.99,3.58 ; 51,7.3 53.69,9.99 61.41,9.99 ; 51,7.3 51,9.87 v1(49.71,11.16) ; C8.1 75.5,15.98 75.5,15.35 71.14,11 71.14,7.84 70.58,7.27 66.45,7.27 63.71,10.01 ; 8.57,2.68 8.76,2.49 ; 8.76,2.49 10.24,1.01 19.56,1.01 ; 8.76,2.49 10.13,3.86 10.13,4.86 ; 8.76,2.49 8.7,2.44 ; 19.64,1.05 19.6,1.01 19.56,1.01 ; 19.64,1.05 19.56,1.01 ; 19.64,1.05 20.97,2.38 ; 75.22,16.39 75.3,16.31 ; 61.42,9.97 61.91,9.48 62.17,9.48 ; 63.7,10.11 63.38,10.43 62.75,10.43 62.65,10.53 ; 62.65,9.4 63.24,9.4 63.7,9.86 ; 75.37,16.24 76.66,16.24 76.92,16.49 83.37,16.49 83.97,15.89 ; R20.1 90.48,54.34 90.48,58.41 91.88,59.8 96.32,59.8 97.72,58.41 97.72,51.68 ; 97.72,51.68 96.39,50.35 R18.1 ; 97.72,51.68 97.72,40.5 97.34,40.12 92,40.12 90.23,41.9 90.23,44.56 90.05,44.74 88.69,44.74 LCD2.24 ; 62.1,10.68 62.1,10.71 ; 85.72,19.43 84.66,18.37 84.66,16.8 84.68,16.78 84.68,16.41 84.07,15.8
  Bottom Layer w0.2: R17.2 17.56,39.85 16.43,39.85 ; 16.43,39.85 16.57,39.99 16.57,44.83 16.4,45 16.4,46.15 CARD1.4 ; 16.43,39.85 13.16,39.85 R1.2
  Bottom Layer w0.254: CARD1.4 16.27,46.52 17.29,47.54 19.89,47.54 20.15,47.28 20.15,12.66 21.65,11.16 v1(49.71,11.16)
+5V: length 972.3
  Top Layer w0.2: v1(77.71,25.15) 77.71,25.15 70.34,25.15 69.58,24.37 ; C26.2 85.59,53.09 85.16,53.09 85.06,52.99 85.06,49.05 ; U12.A2 89.58,52.96 89.58,53.08 89.72,53.23 v1(89.72,53.45) ; 85.72,53.33 87.48,53.33 ; 86.7,49.46 86.7,49.8 87.94,51.03 89.6,51.03 89.76,50.88 89.76,49.54 89.53,49.31 89.53,48.9 ; C27.2 87.89,53.72 v1(87.95,53.72) ; C12.2 87.51,49.37 C13.2 ; 84.87,34.13 84.91,34.16 ; SW5.0 58.05,1.1 57.76,0.81 51.36,0.81 49.39,2.78 ; v1(72.7,14.72) 72.7,15.97 72.71,15.98 ; 84.71,33.97 83.34,35.34 82.78,35.34
  Top Layer w0.254: 84.87,45.02 84.87,48.86 85.06,49.05 ; 84.87,45.02 84.59,44.73 LED61.2 ; 84.87,45.02 84.87,41.1 ; 80.92,8.41 81.61,9.11 81.61,11.13 81.93,11.45 82.84,11.45 82.85,11.46 ; 80.92,8.41 80.99,8.41 81.55,7.85 ; 80.92,8.41 80.91,8.41 74.57,8.41 70.39,4.22 66.93,4.22 ; 63.8,3.31 62.57,3.31 60.59,1.34 ; v1(87.05,18.66) 87.05,15.6 85.87,14.42 84.39,14.42 84.02,14.05 84.02,12.55 83.66,12.19 83.64,12.19 U4.7 ; 42.22,16.37 41.99,16.6 LED120.2 ; 42.22,16.37 42.22,14 LED127.2 ; 42.22,16.37 42.22,20.48 ; LED75.2 83.72,39.95 84.87,41.1 ; v1(57.59,13.58) 57.59,13.59 57.53,13.64 53.31,13.64 53.14,13.81 53.14,13.83 51.75,15.23 51.75,17.38 47.07,22.06 47.07,23.67 46.06,24.68 46.06,26.68 40.81,26.68 LED111.2 40.49,26.1 42.22,24.37 42.22,20.48 ; 63.94,3.52 64.64,4.22 66.93,4.22 ; LED14.2 83.98,58.82 85.02,57.77 85.02,54.01 ; 86.57,49.33 86.61,49.37 86.7,49.46 ; 87.61,49.39 87.58,49.43 87.52,49.43 ; 42.22,20.48 41.49,21.22 LED113.2 ; 66.74,3.16 66.9,3.32 ; LED28.2 84.95,54.08 85.02,54.01 ; 70.09,1.16 67.88,3.37 66.93,3.37 ; 85.02,54.01 v1(85.02,52.56) ; v1(58.22,7.61) 59.37,6.46 v1(59.37,4.69) ; 85.06,49.05 84.78,49.34 LED42.2 ; 85.06,49.05 85.38,49.37 C13.2 ; 72.17,30.91 72.35,30.91 75.65,27.61 75.65,25.17 ; 84.87,41.1 84.87,34.13 84.71,33.97 84.71,27.95 81.94,25.19 81.96,25.17 arc(81.9,25.17) 81.85,25.15 v1(77.71,25.15) ; 66.93,3.37 66.93,4.22 ; 66.93,3.37 66.85,3.37 ; 67.89,24.36 69.57,24.36 ; LED105.2 34.86,26.6 34.46,27 ; SW5.0 60.25,1.21 v1(60.25,2.27) ; 69.67,24.46 69.58,24.37
  Top Layer w0.3: 29.52,17.55 29.48,17.52 LED118.2 ; 29.52,17.55 24.14,17.55 ; 29.52,17.55 34.91,17.55 ; 61.89,36.3 66.99,36.3 ; 61.89,36.3 61.78,36.18 61.78,35.45 LED81.2 ; 61.89,36.3 56.25,36.3 ; 66.99,36.3 72.19,36.3 ; 66.99,36.3 66.95,36.25 LED82.2 ; 24.44,36.3 29.67,36.3 ; 24.44,36.3 19.16,36.3 ; 24.44,36.3 24.44,35.63 LED74.2 ; 29.67,36.3 29.7,36.26 LED80.2 ; 29.67,36.3 34.97,36.3 ; 56.25,36.3 56.37,36.18 LED86.2 ; 56.25,36.3 51.03,36.3 ; LED102.2 18.94,26.18 18.94,27 ; 50.81,41.06 45.55,41.06 ; 50.81,41.06 50.81,40.03 LED65.2 ; 50.81,41.06 55.92,41.06 ; 45.55,41.06 40.02,41.06 ; 45.55,41.06 45.55,40.01 LED64.2 ; 19.18,41.06 18.86,40.74 LED59.2 ; 19.18,41.06 24.07,41.06 ; 19.18,41.06 13.54,41.06 ; LED84.2 72.19,35.41 72.19,36.3 ; 55.98,55.1 61.51,55.1 ; 55.98,55.1 56.19,54.89 56.19,54.25 56.31,54.13 ; 55.98,55.1 50.32,55.1 ; 61.51,55.1 67.08,55.1 ; 61.51,55.1 61.66,54.95 61.66,54.13 ; 34.96,45.67 34.82,45.54 LED47.2 ; 34.96,45.67 39.94,45.67 ; 34.96,45.67 29.23,45.67 ; 76.42,41.06 81.35,41.06 82.25,40.16 82.7,40.16 LED75.2 ; 76.42,41.06 71.92,41.06 ; 76.42,41.06 LED70.2 ; 18.94,27 13.7,27 ; 18.94,27 24.12,27 ; 19.1,50.41 15.88,50.41 14.98,49.51 LED29.2 ; 19.1,50.41 19.1,49.73 LED30.2 ; 19.1,50.41 29.67,50.41 ; LED110.2 24.06,22.13 24.01,22.18 ; LED26.2 45.47,54.73 45.09,55.1 ; 19.05,12.87 24.67,12.87 ; 19.05,12.87 13.7,12.87 ; 19.05,12.87 19.07,12.85 LED123.2 ; 24.67,12.87 29.91,12.87 ; 24.67,12.87 24.67,12.21 LED124.2 ; 24.07,41.06 24.31,40.82 24.31,40.13 LED60.2 ; 24.07,41.06 29.14,41.06 ; 24.12,27 29.47,27 ; 24.12,27 24.15,26.97 LED103.2 ; 29.47,27 29.5,26.97 LED104.2 ; 29.47,27 38.89,27 39.81,26.08 40.22,26.08 LED111.2 ; 71.75,55.1 77.39,55.1 ; 71.75,55.1 72.14,54.71 LED31.2 ; 71.75,55.1 67.08,55.1 ; 77.39,55.1 77.5,55 LED27.2 ; 77.39,55.1 81.82,55.1 LED28.2 ; 34.83,12.87 34.9,12.79 LED131.2 ; 34.83,12.87 38.72,12.87 39.56,12.03 40.01,12.03 LED127.2 ; 34.83,12.87 29.91,12.87 ; 55.92,41.06 56.05,40.94 LED132.2 ; 55.92,41.06 61.28,41.06 ; LED8.2 50.95,59.01 50.95,59.8 ; 71.92,41.06 72.18,40.8 LED69.2 ; 71.92,41.06 66.96,41.06 ; LED77.2 40.4,36.24 40.35,36.3 ; LED79.2 51.03,35.37 51.03,36.3 ; 14.12,22.18 10.48,22.18 9.58,21.28 LED107.2 ; 14.12,22.18 18.94,22.18 ; 14.12,22.18 13.48,21.54 LED108.2 ; LED100.2 9.59,26.08 10.51,27 13.7,27 ; 72.17,30.91 71.73,30.91 70.82,31.81 66.79,31.81 ; 40.35,36.3 51.03,36.3 ; 40.35,36.3 34.97,36.3 ; 45.38,30.84 45.44,30.9 45.44,31.81 ; 19.12,45.67 19.12,45.03 LED44.2 ; 19.12,45.67 15.86,45.67 14.96,44.77 LED43.2 ; 19.12,45.67 24.21,45.67 ; 55.37,45.67 50.8,45.67 ; 55.37,45.67 56.27,44.78 LED56.2 ; 55.37,45.67 60.61,45.67 ; 50.8,45.67 45.62,45.67 ; 50.8,45.67 50.88,45.58 LED50.2 ; 13.7,12.87 10.59,12.87 9.75,12.03 LED126.2 ; 13.7,12.87 13.7,12.08 LED122.2 ; 61.73,59.8 72.12,59.8 ; 61.73,59.8 61.73,58.98 LED10.2 ; 61.73,59.8 56.37,59.8 ; 72.12,59.8 76.95,59.8 ; 72.12,59.8 72.12,58.91 LED12.2 ; LED54.2 71.32,45.67 ; 71.32,45.67 66.71,45.67 ; 71.32,45.67 77.49,45.67 ; LED114.2 9.62,16.65 10.52,17.55 13.66,17.55 ; 24.34,31.81 24.19,31.66 LED90.2 ; 24.34,31.81 29.13,31.81 ; 24.34,31.81 18.95,31.81 ; 40.14,50.41 45.49,50.41 ; 40.14,50.41 40.2,50.35 LED34.2 ; 40.14,50.41 34.92,50.41 ; 45.49,50.41 45.55,50.35 LED35.2 ; 45.49,50.41 50.82,50.41 ; 35.23,55.1 35.23,54.68 LED19.2 ; 35.23,55.1 40.25,55.1 ; 35.23,55.1 28.99,55.1 ; 40.25,55.1 42.41,55.1 42.47,55.16 44.12,55.16 44.18,55.1 45.09,55.1 ; 40.25,55.1 40.09,54.95 LED20.2 ; 19.19,55.1 19.19,54.7 LED21.2 ; 19.19,55.1 23.92,55.1 ; 19.19,55.1 14.53,55.1 13.63,54.2 LED15.2 ; LED117.2 24.13,17.54 24.14,17.55 ; 40.02,41.06 40.18,40.91 LED63.2 ; 40.02,41.06 34.78,41.06 ; 56.13,31.81 56.11,31.8 56.11,30.91 ; 56.13,31.81 61.59,31.81 ; 56.13,31.81 50.69,31.81 ; 19.08,59.8 24.08,59.8 ; 19.08,59.8 19.08,59.18 LED3.2 ; 19.08,59.8 14.34,59.8 LED83.2 ; 24.08,59.8 24.08,58.83 LED4.2 ; 24.08,59.8 29.54,59.8 ; 61.66,50.41 61.66,49.42 LED38.2 ; 61.66,50.41 67.04,50.41 ; 61.66,50.41 56.42,50.41 ; LED57.2 9.61,40.16 10.51,41.06 13.54,41.06 ; 29.91,12.87 29.91,12.1 LED125.2 ; 66.71,45.67 66.97,45.4 LED53.2 ; 66.71,45.67 60.61,45.67 ; 23.92,55.1 24.03,55 LED17.2 ; 23.92,55.1 28.99,55.1 ; 66.82,30.91 66.82,31.78 66.79,31.81 ; LED55.2 77.68,45.48 77.49,45.67 ; 45.09,55.1 50.32,55.1 ; 45.44,31.81 50.69,31.81 ; 45.44,31.81 34.63,31.81 ; 50.69,31.81 50.69,30.88 50.73,30.84 ; LED13.2 77.39,59.36 76.95,59.8 ; 50.95,59.8 56.37,59.8 ; 50.95,59.8 45.78,59.8 ; 56.37,59.8 56.37,58.97 LED9.2 ; 28.99,55.1 29.38,54.71 LED18.2 ; LED115.2 13.66,16.78 13.66,17.55 ; 24.14,17.55 18.85,17.55 ; LED113.2 40.09,21.28 39.65,21.28 38.74,22.18 34.72,22.18 ; 50.82,50.41 50.84,50.39 LED41.2 ; 50.82,50.41 56.42,50.41 ; 13.7,27 13.65,26.95 13.65,26.24 LED106.2 ; 72.19,36.3 77.44,36.3 ; 77.44,36.3 77.53,36.2 LED85.2 ; 77.44,36.3 81.38,36.3 82.3,35.38 82.74,35.38 82.78,35.34 ; 19.16,36.3 19.16,35.7 LED73.2 ; 19.16,36.3 13.72,36.3 ; LED39.2 67.04,49.44 67.04,50.41 ; 61.59,31.81 66.79,31.81 ; 61.59,31.81 61.47,31.69 61.47,30.91 ; LED62.2 34.78,40.03 34.78,41.06 ; 34.91,17.55 34.91,16.67 LED119.2 ; 34.91,17.55 38.66,17.55 39.56,16.65 40,16.65 LED120.2 ; 29.54,59.8 35.09,59.8 ; 29.54,59.8 29.54,58.94 LED5.2 ; 35.09,59.8 40.71,59.8 ; 35.09,59.8 35.09,59.14 LED6.2 ; 34.63,31.81 34.67,31.77 LED92.2 ; 34.63,31.81 29.13,31.81 ; 77.54,50.41 77.54,49.4 LED46.2 ; 77.54,50.41 72.56,50.41 ; 77.54,50.41 81.44,50.41 82.34,49.51 82.79,49.51 LED42.2 ; LED51.2 29.47,45.43 29.23,45.67 ; LED71.2 9.58,35.38 10.5,36.3 13.72,36.3 ; 77.49,45.67 81.55,45.67 82.45,44.77 82.9,44.77 LED61.2 ; 29.13,31.81 29.38,31.56 LED96.2 ; LED45.2 24.21,45.66 24.21,45.67 ; 40.71,59.8 45.78,59.8 ; 40.71,59.8 40.71,59.43 LED11.2 ; 45.78,59.8 45.78,59.04 LED7.2 ; 66.96,41.06 61.28,41.06 ; 66.96,41.06 66.84,40.95 LED68.2 ; LED36.2 24.44,49.76 24.44,50.28 ; 61.28,41.06 61.47,40.87 LED67.2 ; LED49.2 45.53,45.58 45.62,45.67 ; 18.94,22.18 18.94,21.38 LED109.2 ; 18.94,22.18 24.01,22.18 ; 56.42,50.41 56.42,49.53 LED37.2 ; 67.08,55.1 67.01,55.04 67.01,54.13 ; 24.01,22.18 29.52,22.18 ; 34.92,50.41 34.92,49.53 LED33.2 ; 34.92,50.41 29.67,50.41 ; LED48.2 40.18,45.43 39.94,45.67 ; 45.62,45.67 39.94,45.67 ; 13.6,31.81 10.62,31.81 9.58,30.77 LED87.2 ; 13.6,31.81 13.6,30.89 LED88.2 ; 13.6,31.81 18.95,31.81 ; 13.66,17.55 18.85,17.55 ; 18.85,17.55 18.71,17.41 LED121.2 ; LED72.2 13.72,35.61 13.72,36.3 ; LED66.2 29.47,40.73 29.14,41.06 ; 24.21,45.67 29.23,45.67 ; 34.78,41.06 29.14,41.06 ; 60.61,45.67 60.61,45.67 LED52.2 ; LED40.2 72.56,49.61 72.56,50.41 ; 34.97,36.3 35.05,36.22 LED76.2 ; 67.04,50.41 72.56,50.41 ; LED78.2 45.65,35.34 45.65,36.18 ; 76.95,59.8 81.75,59.8 LED14.2 ; 18.95,31.81 18.95,30.88 LED89.2 ; 13.54,41.06 13.54,40.19 LED58.2 ; 29.67,50.41 29.67,49.64 LED32.2 ; LED116.2 29.52,21.42 29.52,22.18 ; 67.11,59.68 67.11,59.12 LED16.2 ; LED22.2 50.84,54.58 50.32,55.1 ; LED112.2 34.8,22.1 34.72,22.18 ; 29.52,22.18 34.72,22.18 ; LED93.2 40.02,31.81
  Bottom Layer w0.2: v1(87.95,53.72) 88,53.76 88.2,53.76 88.5,53.45 v1(89.72,53.45) ; v1(76.64,8.37) 76.64,10.78 v1(72.7,14.72) 72.99,15 73.88,15 78.16,19.29 78.16,24.7 v1(77.71,25.15)
  Bottom Layer w0.254: v1(60.25,2.27) 60.25,3.8 v1(59.37,4.69) ; v1(57.59,13.58) 58.22,12.94 v1(58.22,7.61) ; v1(87.05,18.66) 87.03,18.68 87.03,19.99 86.4,20.62 85.08,20.62 82.73,22.97 v1(82.73,26.02)
GND: length 40.7
  Top Layer w0.2: USB1.B1A12 6.01,45.45 USB1.14 ; v1(72.07,14.46) 72.13,14.53 72.25,14.53 72.51,14.27 72.89,14.27 73.28,14.66 73.28,16.36 73.02,16.62 v1(73.02,16.73) R12.1 ; 55.35,14.33 53.79,14.33 53.71,14.4 ; 55.35,14.33 55.37,14.31 ; 55.35,14.33 55.25,14.43 55.25,15.68 53.96,15.68 ; R3.2 8.69,45.97 v1(8.69,45.07) ; C27.1 88.32,51.85 88.6,51.57 89.25,51.57 v1(89.34,51.48) 89.55,51.7 89.55,52.1 ; R2.2 8.68,49.28 v1(8.19,49.77) ; C9.2 89.4,3.38 R8.1 92.83,6.9 U13.S1 ; 6.47,52.46 5.89,53.04 5.89,53.56 ; 56.86,15.87 56.75,15.77 55.41,15.77 ; 53.68,17.08 55.27,17.08 ; 72.97,17.67 71.91,18.73 71.01,18.73 70.72,19.02 70.72,19.03 69.91,19.84 ; 55.27,17.05 55.22,17 55.25,15.74 ; 56.57,14.33 55.37,14.33
  Top Layer w0.254: 64.81,3.27 64.91,3.38 65.67,3.38 ; U3.3 U3.2 U3.7
  Bottom Layer w0.2: v1(8.69,45.07) 8.69,49.26 v1(8.19,49.77)
  vias: v1(60.52,7.68) v1(62.67,4.43) v1(63.94,2.15) v1(64.7,7.35) v1(65.32,2.36) v1(65.34,24.37) v1(67.51,9.65) v1(69.91,19.8) v1(72.45,7.61) v1(72.57,21.2) v1(75.37,13.32) v1(76.29,14.97) v1(79.85,15.46) v1(85.27,13.45) v1(87.31,45.33) v1(87.42,54.2) v1(89.08,14.97)
PGND: length 0.5
  Top Layer w0.254: 68.61,21.45 68.16,21.45 68.14,21.43
VBUS: length 9.3
  Top Layer w0.2: 7.65,52.22 7.02,51.58 6.19,51.58 ; 7.72,54 7.72,52.27 7.8,52.27 ; v1(6.79,46.85) 6.76,46.82 USB1.B4A9
  Bottom Layer w0.2: v1(6.79,46.85) 7.04,47.1 v1(7.04,51.68)
+BAT: length 49.7
  Top Layer w0.254: 71.26,24.43 71.73,24.43 73.83,22.32 ; 69.21,7.74 70.53,7.74 70.79,7.99 70.79,11.18 73.75,14.14 73.75,14.61 73.83,14.69 73.83,22.32 ; 73.83,22.32 73.94,22.21 84.62,22.21 84.75,22.34 84.75,27.49 85.51,28.24 89.53,28.24 93.69,32.41 P1.1
A: length 41.4
  Top Layer w0.2: v1(66.7,14.2) 66.54,14.35 64.92,14.35 64.77,14.2 62.53,14.2 62.37,14.35 ; R8.2 90.86,2.08 C9.1
  Top Layer w0.254: 93.45,3.93 93.09,3.57 90.73,3.57
  Bottom Layer w0.2: 93.42,3.43 91.75,1.76 80.04,1.76 68.31,13.49 67.41,13.49 v1(66.7,14.2)
B: length 50.1
  Top Layer w0.2: v1(64.58,14.65) 64.02,14.65 63.87,14.81 63.86,14.81 63.71,14.95 63.71,14.96 62.85,15.82
  Top Layer w0.254: 94.24,8.97 93.45,8.97 93.27,9.16 ; 94.24,8.97 94.86,8.35 94.86,6.68 97.36,4.18 97.36,4.01 ; 94.24,8.97 94.19,9.02 ; 94.24,8.97 95.33,8.97
  Bottom Layer w0.2: v1(64.58,14.65) 67.58,14.65 79.48,2.75 90.36,2.75 92.85,5.24 96.28,5.24 97.56,3.96
BACK: length 22.8
  Top Layer w0.2: 24.73,7.05 40.65,7.05 44.19,10.59 U14.38
  Top Layer w0.254: 24.73,7.05 C23.2
BCLK: length 59.8
  Top Layer w0.2: 89.11,52.15 88.99,52.02 v1(88.78,52.02)
  Top Layer w0.254: U6.C1 87.5,46.45 v1(87.29,46.45) ; v1(64.35,18.71) 63.75,18.11 62.58,18.11
  Bottom Layer w0.2: v1(88.78,52.02) 88.88,51.92 88.88,51.3 89.09,51.09 89.09,48.25 v1(87.29,46.45) 85.35,46.45 84.31,45.41 84.31,29.29 83.58,28.56 66.49,28.56 64.57,26.64 64.57,18.93 v1(64.35,18.71)
BUZZER: length 12
  Top Layer w0.254: 62.36,20.86 62.38,20.84 63.81,20.84 64.06,21.1 64.06,24.75 64.43,25.12 68.62,25.12 69.55,26.04 69.55,26.59
CS: length 97.8
  Top Layer w0.2: 56.95,25.92 v1(56.95,26.98)
  Bottom Layer w0.2: 2.38,35.52 5.09,32.81 5.09,12.06 7.16,9.99 50.52,9.99 52.66,12.13 52.66,12.54 53.13,13.02 53.15,25.86 52.53,26.48 51.41,26.48 ; 56.94,27.07 56.3,27.71 51.74,27.71 51.19,27.16 51.19,26.7 51.36,26.53
DIN: length 57.8
  Top Layer w0.2: 89.17,52.51 88.63,52.51 v1(88.42,52.73) ; v1(88.64,48.53) 89.13,48.53 89.17,48.49
  Top Layer w0.254: 62.39,19.63 62.64,19.38 63.99,19.38 v1(64.07,19.46)
  Bottom Layer w0.2: v1(88.42,52.73) 88.34,52.65 88.34,52.22 88.33,52.21 88.33,51.83 88.34,51.83 88.34,48.83 v1(88.64,48.53) 87,48.53 84,45.53 84,29.42 83.45,28.87 66.36,28.87 64.27,26.77 64.27,19.65 v1(64.07,19.46)
EXTRA: length 10.1
  Top Layer w0.254: 35.83,6.43 36.12,6.72 41.59,6.72 44.19,9.32 44.76,9.32
HOME: length 35
  Top Layer w0.254: C20.2 13.91,6.44 14.87,7.4 40.1,7.4 44.33,11.63 44.69,11.63
IN_TRIG: length 77.5
  Top Layer w0.2: C3.1 91.05,11.1 v1(90.99,11.04) ; U14.29 45.33,21.72 46.4,21.72 47.17,20.94 47.17,17.26 51.95,12.48 58.27,12.48 59.87,14.08 v1(59.87,17.51)
  Bottom Layer w0.2: v1(90.99,11.04) 93.53,13.58 94.04,13.58 94.61,13 94.61,12.8 92.8,11 92.8,7.63 92.5,7.32 92.5,7.21 89.16,3.88 79.86,3.88 67.65,16.09 64.4,16.09 62.98,17.51 v1(59.87,17.51)
INT: length 33.9
  Top Layer w0.2: v1(50.57,26.92) 50.56,26.9 50.56,25.81 ; v1(71.66,17.48) 71.66,17.79 71.24,18.21
  Bottom Layer w0.2: 65.84,17.64 65.64,17.44 64.33,17.44 63.89,17.88 63.89,18.84 63.62,19.11 63.62,19.71 63.96,20.06 63.96,27.27 63.2,28.03 56.26,28.03 56.24,28.01 51.62,28.01 51.48,27.88 51.42,27.88 50.59,27.05 ; 65.87,17.64 71.58,17.64 71.71,17.52 ; 71.71,17.56 71.7,17.56
LED: length 5.5
  Top Layer w0.2: 66.11,26.25 66.05,26.19 60.62,26.19
LED_DATA: length 64.4
  Top Layer w0.254: v1(46.54,22.97) 45.34,22.97 U14.28 ; LED83.3 12.12,59.66 v1(12.12,59.93)
  Bottom Layer w0.254: v1(12.12,59.93) 23.95,48.1 28.56,48.1 50.6,26.06 50.6,22.05 50.42,21.87 47.64,21.87 v1(46.54,22.97)
LRCLK: length 61.1
  Top Layer w0.2: U12.C3 89.97,52.1 v1(89.97,51.42)
  Top Layer w0.254: 62.79,17.06 62.79,17.05 63.41,17.05 v1(64.38,18.03) ; 89.95,48.11 89.95,47.35 v1(88.82,46.23)
  Bottom Layer w0.2: v1(64.38,18.03) 64.43,18.03 64.87,18.46 64.87,26.52 66.61,28.26 83.71,28.26 84.61,29.17 84.61,45.28 85.32,46 88.67,46 88.82,46.15 v1(88.82,46.23) 89.97,47.38 v1(89.97,51.42)
MIC_SCK: length 37.6
  Top Layer w0.2: U14.24 49.46,25.71 49.46,22.21 52.56,19.11 57.64,19.11 v1(57.84,18.91) ; U1.4 v1(73.59,2.67)
  Bottom Layer w0.2: v1(73.59,2.67) 73.59,3.55 72.51,4.63 72.5,4.63 71.81,5.32 70.8,5.32 57.84,18.27 v1(57.84,18.91)
MIC_SD: length 40.2
  Top Layer w0.2: v1(48.95,22.47) 48.95,21.7 52,18.66 v1(57.21,18.66) ; v1(46.87,24.55) 46.79,24.63 U14.26 ; R23.2 75.65,4.19 73.86,4.19 73.72,4.05 73.72,3.68 U1.6 73.18,3.84 73.18,3.86 73.03,4 73.01,4 72.84,4.18 v1(72.32,4.18)
  Bottom Layer w0.2: v1(72.32,4.18) 71.51,4.18 57.21,18.48 v1(57.21,18.66) ; v1(48.95,22.47) v1(46.87,24.55)
MIC_WS: length 37.7
  Top Layer w0.2: U14.25 48.06,21.96 51.87,18.15 v1(56.83,18.15) ; v1(69.02,3.54) 69.07,3.49 U1.1
  Bottom Layer w0.2: v1(69.02,3.54) 69.02,6.24 57.11,18.15 v1(56.83,18.15)
MISO: length 64.6
  Top Layer w0.254: v1(20.76,42.15) 9.71,42.15 v1(9.33,42.53) ; v1(52.17,23.68) 52.38,23.89 52.38,23.99 53.14,24.74 53.14,25.84
  Bottom Layer w0.2: R1.1 13.14,44.96 12.97,45.13 CARD1.7
  Bottom Layer w0.254: v1(52.17,23.68) 50.96,22.47 50.96,21.91 50.57,21.52 47.32,21.52 45.15,23.68 43.55,23.68 25.08,42.15 v1(20.76,42.15) ; v1(9.33,42.53) 11.99,42.53 R1.1
MOSI: length 122.9
  Top Layer w0.2: v1(55.69,26.96) 55.72,26.94 55.72,26.15
  Bottom Layer w0.2: 55.67,27.03 55.58,27.03 55.2,27.41 53.88,27.41 53.73,27.26 53.73,26.97 53.93,26.77 53.93,11.88 50.8,8.76 6.88,8.76 6.74,8.9 6.74,9.02 4.18,11.58 4.18,25.42 2.71,26.9 ; CARD1.3 17.5,46.15 17.5,41.47 R17.1 18.47,40.49 18.47,39.61 18.27,39.41 18.27,39.37 17.41,38.51 2.13,38.51 1.2,37.58 1.2,28.52 LCD2.28
OUT+: length 13.5
  Top Layer w0.2: U2.7 92.5,15.73 92.89,16.12 92.89,24.46 P4.2
OUT-: length 9.6
  Top Layer w0.2: P4.1 93.4,19.96 93.4,15.48 92.65,14.73 U2.9
OUTN: length 8.2
  Top Layer w0.254: P2.1 95.56,43.06 90.12,48.5 89.96,48.5 89.96,48.51
OUTN_2: length 5.7
  Top Layer w0.254: P3.1 95.16,52.53 U12.B3
OUTP: length 6.1
  Top Layer w0.254: P2.2 94.34,48.91 89.96,48.91
OUTP_2: length 8.4
  Top Layer w0.254: U12.A3 91.86,52.93 95.53,56.6 P3.2
RESET: length 79.7
  Top Layer w0.2: 62.23,11.81 62.1,11.95 53.48,11.95
  Bottom Layer w0.2: 2.35,30.15 4.48,28.02 4.48,11.72 7.15,9.06 50.61,9.06 53.52,11.98 53.52,12.06 53.47,12.12 53.44,12.09 v1(53.44,12.03)
RS: length 89.4
  Top Layer w0.2: v1(51.86,27.07) 51.87,27.06 51.87,25.62
  Bottom Layer w0.2: 2.49,32.27 4.79,29.96 4.79,11.85 7.16,9.48 50.43,9.48 52.96,12.01 52.96,12.42 53.51,12.97 53.51,26 52.45,27.06 ; 52.44,27.05 51.8,27.05 51.77,27.09
SCK: length 118.7
  Top Layer w0.2: v1(54.38,26.96) 54.38,26.08 54.16,25.85
  Bottom Layer w0.2: 54.38,26.96 54.36,26.94 54.36,11.88 50.91,8.43 6.78,8.43 3.87,11.34 3.87,23.78 2.4,25.25 ; CARD1.5 15.3,46.14 R19.1 15.29,41.39 14.66,41.39 13.8,40.53 12.53,40.53 10.82,38.81 1.8,38.81 0.82,37.83 0.82,26.36 LCD2.27
SCL: length 116.5
  Top Layer w0.2: 70.1,17.58 70.1,17.13 v1(70.51,16.72) ; R24.1 93.78,12.44 v1(93.78,13.07) ; v1(74.73,12.05) 73.47,10.79 72.95,10.79 71.86,9.7 71.86,6.45 70.71,5.3 69.31,5.3 ; LED2.1 51.16,3.78 S1.6 ; 67.33,27.51 59.6,27.51 58.22,26.13
  Top Layer w0.254: U3.6 44.18,5.12 44.4,5.34 44.4,6.01 44.97,6.58 51.23,6.58 51.74,6.07 LED2.1 ; 51.72,2.8 51.72,1.55 52.12,1.14 57.62,1.14 61.8,5.31 69.02,5.31
  Bottom Layer w0.2: v1(93.78,13.07) 92.13,11.42 92.13,7.35 88.96,4.18 80.19,4.18 74.73,9.63 v1(74.73,12.05) 73.78,13 72.51,13 70.01,15.51 70.01,16.37 70.36,16.72 v1(70.51,16.72) 70.51,16.28 70.57,16.21 70.57,15.86 71.03,15.41 72.53,15.41 74.98,17.87 v1(74.98,19.16) 74.83,19.31 74.83,19.41 74.57,19.67 74.47,19.67 73.33,20.81 73.33,25.66 72.7,26.29 72.7,26.36 71.29,27.78 67.51,27.78 67.38,27.64 v1(67.38,27.56)
SD_CS: length 62
  Top Layer w0.2: v1(50.09,24.12) 51.68,22.54 57.02,22.54 59.49,25.01 59.49,25.84 U14.16
  Bottom Layer w0.2: v1(50.09,24.12) 47.17,27.04 41.08,27.04 20.25,47.87 11.87,47.87 10.77,46.77 CARD1.9
SDA: length 108.6
  Top Layer w0.2: 70.62,17.35 70.94,17.35 v1(71.24,17.05) ; v1(55.56,4.43) 55.56,3.72 55.81,3.47 LED2.4 ; v1(74.05,12.07) 73.07,11.09 72.75,11.09 71.51,9.84 71.51,6.76 71.32,6.57 69.31,6.57 ; v1(74.38,19.22) 74.38,19.44 v1(75.11,20.18) ; v1(97.21,19.04) 97.84,19.04 R25.1 ; U14.12 63.09,22.59 63.38,22.59 63.52,22.74 63.52,24.97 64.06,25.51 67.76,25.51 67.96,25.71 67.96,27.25 v1(68.01,27.3) ; S1.1 46.91,4.43 v1(51.11,4.43)
  Top Layer w0.254: 55.81,3.47 59.29,3.47 61.65,5.83 67.82,5.83 68.57,6.58 ; S1.1 45.92,4.12 U3.4
  Bottom Layer w0.2: v1(74.05,12.07) 73.41,12.7 72.3,12.7 69.65,15.35 69.65,16.79 70.12,17.26 70.92,17.26 71.14,17.05 v1(71.24,17.05) 71.24,16.65 70.92,16.33 70.92,16.01 71.17,15.76 71.42,15.76 74.38,18.73 v1(74.38,19.22) 73.03,20.57 73.03,25.54 71.27,27.3 v1(68.01,27.3) ; v1(75.11,20.18) 75.11,23.86 77.02,25.77 78.27,25.77 78.92,25.12 78.92,24.5 79.18,24.24 79.18,23.86 84.89,18.15 96.32,18.15 v1(97.21,19.04) ; v1(51.11,4.43) v1(55.56,4.43)
SW: length 49.4
  Top Layer w0.2: v1(66,13.89) 63.88,13.89 63.24,13.24 62.38,13.24
  Top Layer w0.254: 96.79,8.99 97.59,8.99 ; 93.4,1.35 94.75,2.7 97.81,2.7 98.65,3.53 98.65,7.91 97.59,8.97
  Bottom Layer w0.2: v1(66,13.89) 66.71,13.18 68.19,13.18 79.91,1.46 93.55,1.46
USB_DN: length 132.1
  Top Layer w0.2: v1(6.09,7.05) 5.95,7.05 0.94,12.06 0.95,43.08 3.78,45.91 3.78,48.69 5.09,50 5.89,50 ; 6.28,50.01 6.31,49.98 7.52,49.98 7.66,49.84 7.66,49.13 7.47,48.94 6.27,48.94 ; 61.5,23.49 61.55,23.44 62.19,23.44 ; 69.15,17.63 69.17,17.61 ; 69.15,17.11 68.35,16.31 v1(68.11,16.31) ; 69.15,17.11 69.15,17.63 ; 69.15,17.11 69.15,17.09
  Bottom Layer w0.2: v1(6.09,7.05) 6.59,7.54 50.87,7.54 54.97,11.63 54.97,17.75 60.79,23.58 61.48,23.58 ; 68.04,16.39 64.52,16.39 63.01,17.9 63.01,19.96 63.06,20.01 63.06,22.5 62.09,23.46 v1(61.43,23.46)
USB_DP: length 129.7
  Top Layer w0.2: 2.29,43.94 1.33,42.97 1.33,12.1 5.72,7.7 v1(6.11,7.7) ; 4.81,49.02 4.08,48.29 4.08,45.74 2.31,43.97 ; 4.81,49.02 4.81,49.29 5.01,49.49 5.87,49.49 ; 4.81,49.02 4.81,48.63 4.95,48.49 6.08,48.49 6.1,48.47 ; v1(68.3,16.93) 68.31,16.93 68.6,17.22 68.6,17.47 ; v1(60.12,23.75) 60.99,24.62 62.37,24.62
  Bottom Layer w0.2: 68.25,16.91 64.43,16.91 63.59,17.75 63.59,17.79 63.36,18.02 63.36,18.94 63.32,18.99 63.32,19.84 63.36,19.88 63.36,22.62 62.07,23.92 60.29,23.92 v1(60.12,23.75) 54.66,18.29 54.66,11.76 51.04,8.13 6.53,8.13 v1(6.11,7.7)
$1N6578: length 2.9
  Top Layer w0.2: 5.97,50.47 6,50.5 6.4,50.5 ; 6.4,50.44 8.66,50.44 8.8,50.58
$1N6634: length 2.7
  Top Layer w0.2: 6.05,47.43 6.06,47.42 8.77,47.42
$1N7983: length 4.1
  Top Layer w0.254: 82.98,14.06 82.95,14.04 80.92,14.04 ; 82.42,15.9 82.64,15.68 82.64,14.3 82.43,14.08
$1N8057: length 26.4
  Top Layer w0.254: 81.61,6.1 82.54,7.04 84,7.04 87.34,10.37 87.34,11.83 88.35,12.84 88.69,12.84 ; 81.61,6.1 81.47,5.97 ; 81.61,6.1 81.67,6.03 ; 81.61,6.1 81.25,6.46 v1(80.83,6.46) ; 83.04,19.49 83.71,18.82 83.71,16.95
  Bottom Layer w0.254: v1(80.83,6.46) 80.83,14.06 v1(83.69,16.91)
$1N8372: length 7.4
  Top Layer w0.254: 88.92,10.24 87.71,10.24 83.62,6.15 83.23,6.15
$1N8401: length 15.2
  Top Layer w0.254: 83.06,8.01 84.38,9.32 84.38,13.9 84.54,14.06 87.17,14.06 87.89,13.35 89.76,13.35 90.04,13.07 90.04,11.78 89.86,11.6 88.85,11.6 88.83,11.61
$1N8430: length 4.2
  Top Layer w0.254: 78.88,19.57 78.88,19.49 77.05,17.66 ; 76.98,17.72 77,17.74 ; 75.36,17.59 76.86,17.59
$1N18930: length 2.8
  Top Layer w0.254: 66.14,15.81 66.23,15.81 68.14,17.71
$1N18990: length 5.4
  Top Layer w0.254: 66.21,23.23 66.21,19.38 66.83,18.76 67.49,18.76
$1N19229: length 2.6
  Top Layer w0.254: 69.61,16.45 69.61,17.55 ; 68.58,15.41 69.62,16.45
$1N19351: length 1.8
  Top Layer w0.2: 70.36,15.95 70.05,15.64 70.05,15.43
  Top Layer w0.254: 71.55,15.99 71.54,16 70.36,16
